# EAGLE design Mixer-Analog-OPA1644-Rev-C (EAGLE 8.4.3)
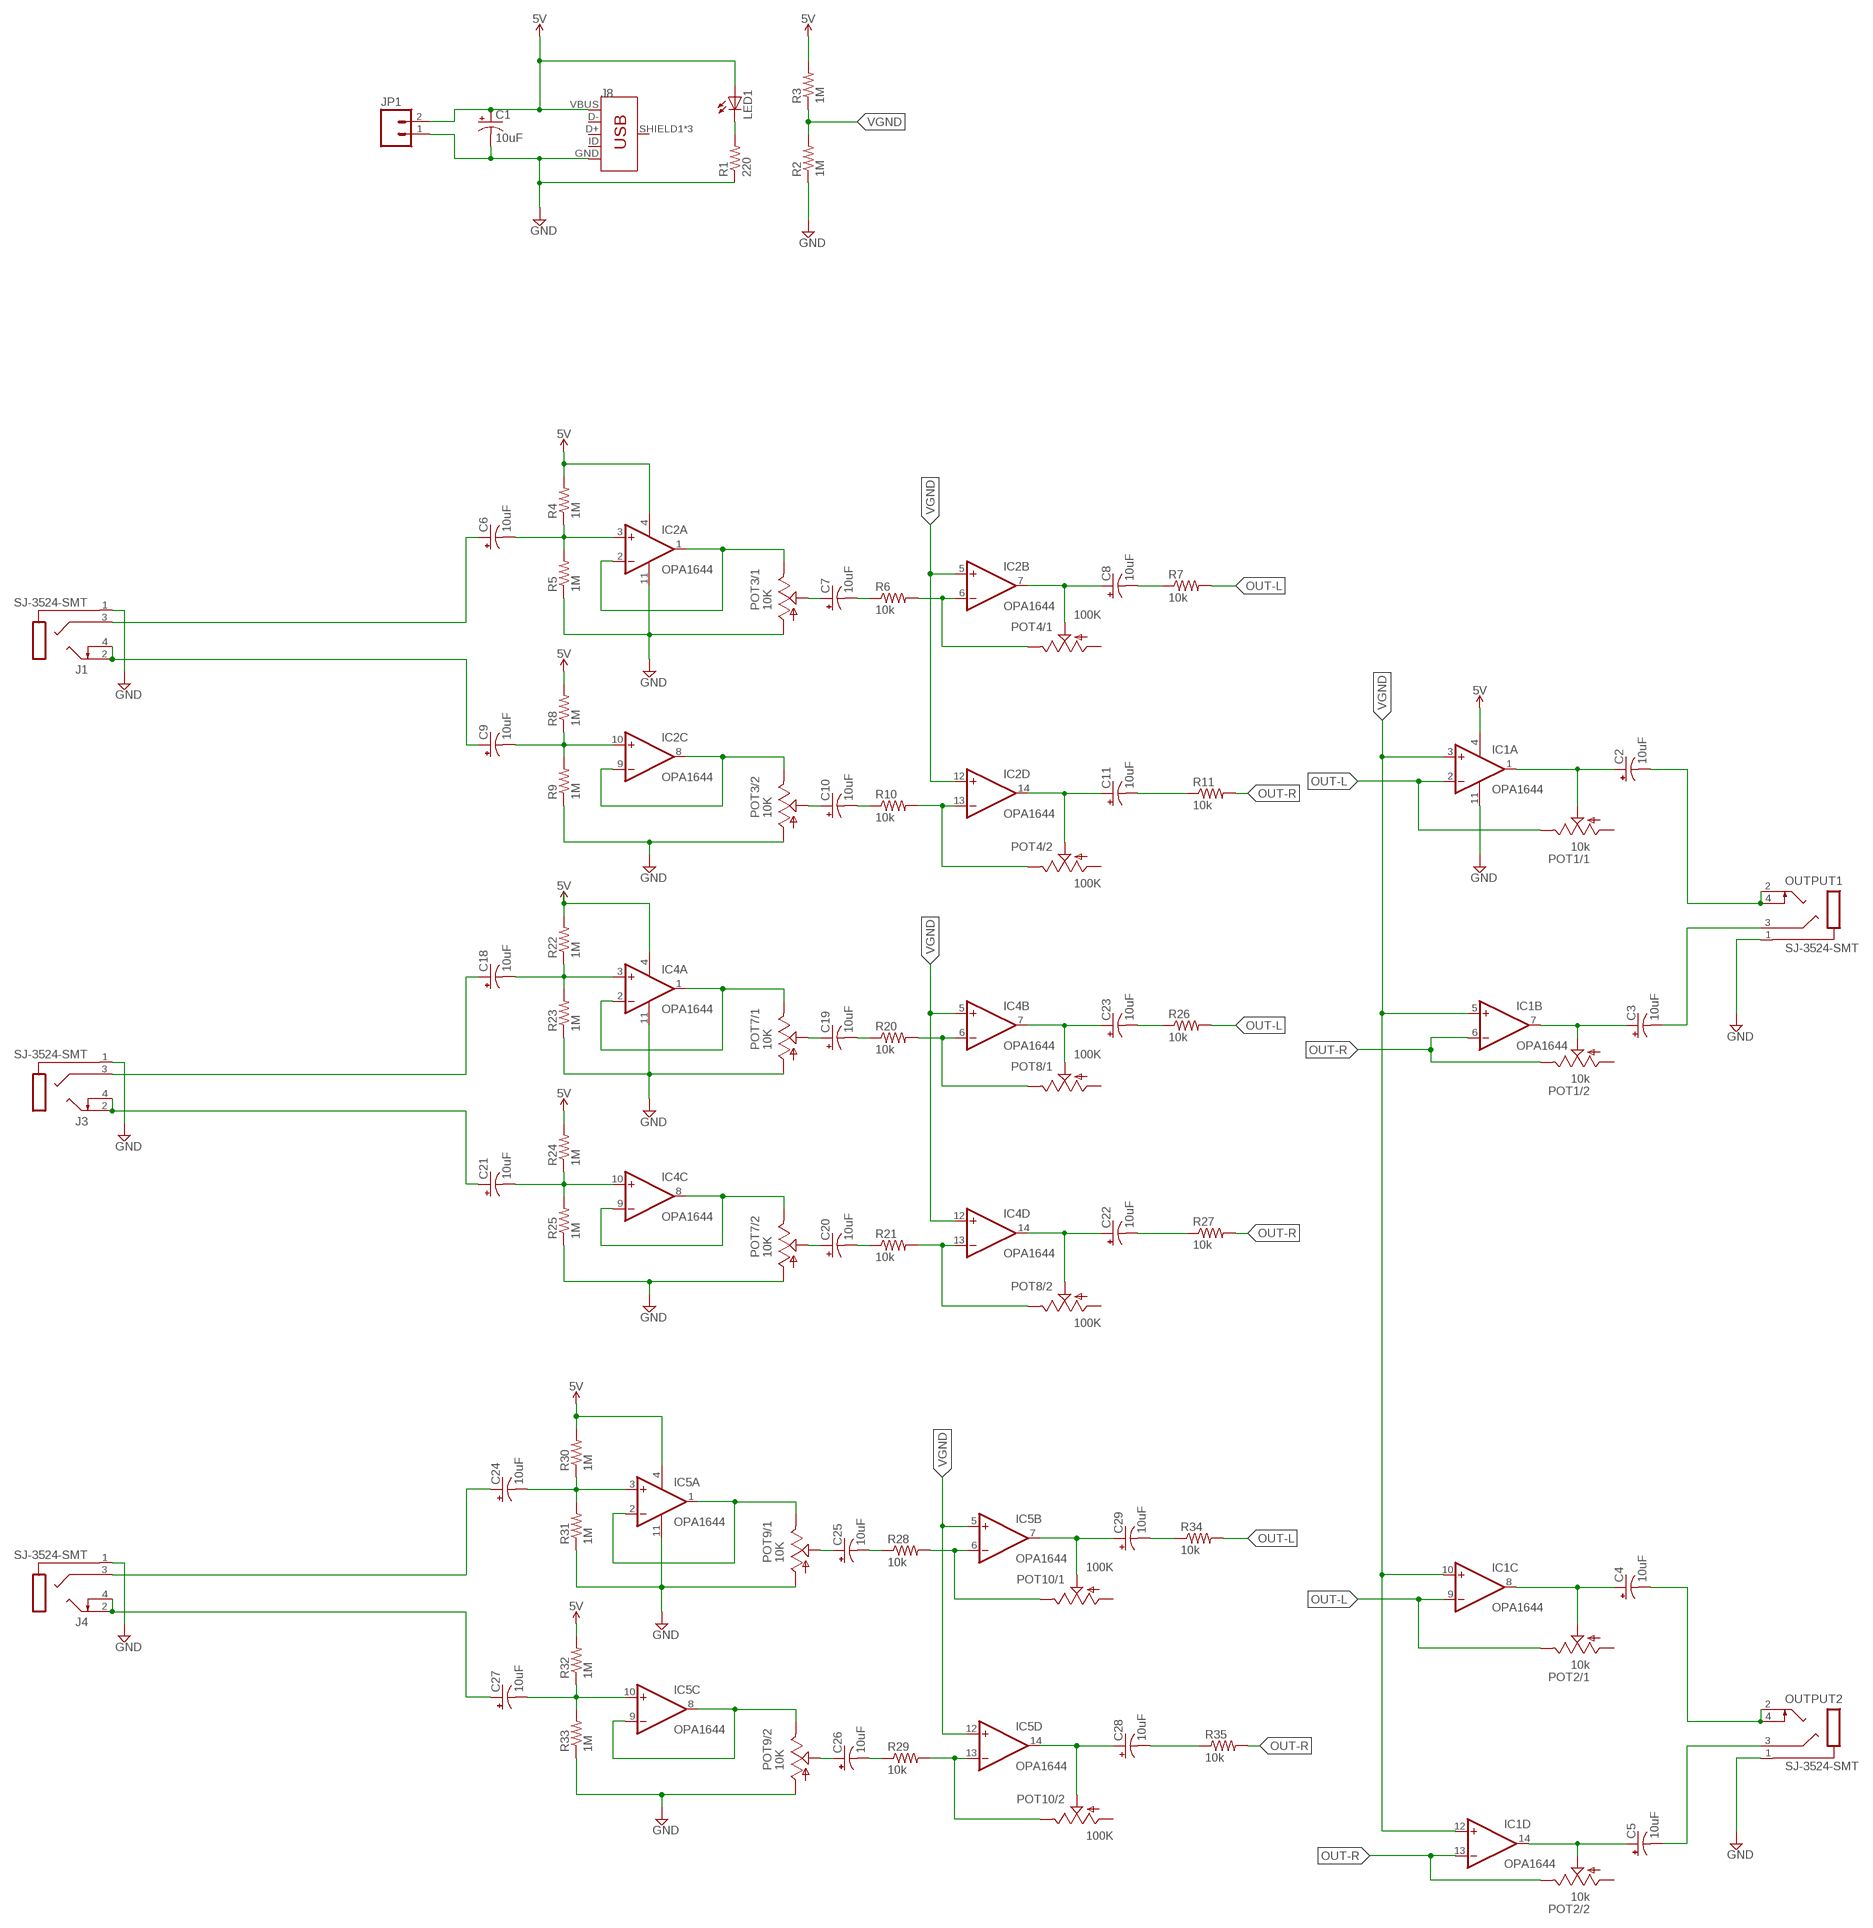
[diagram p0: schematic, sheet 1, part 1 of 2]
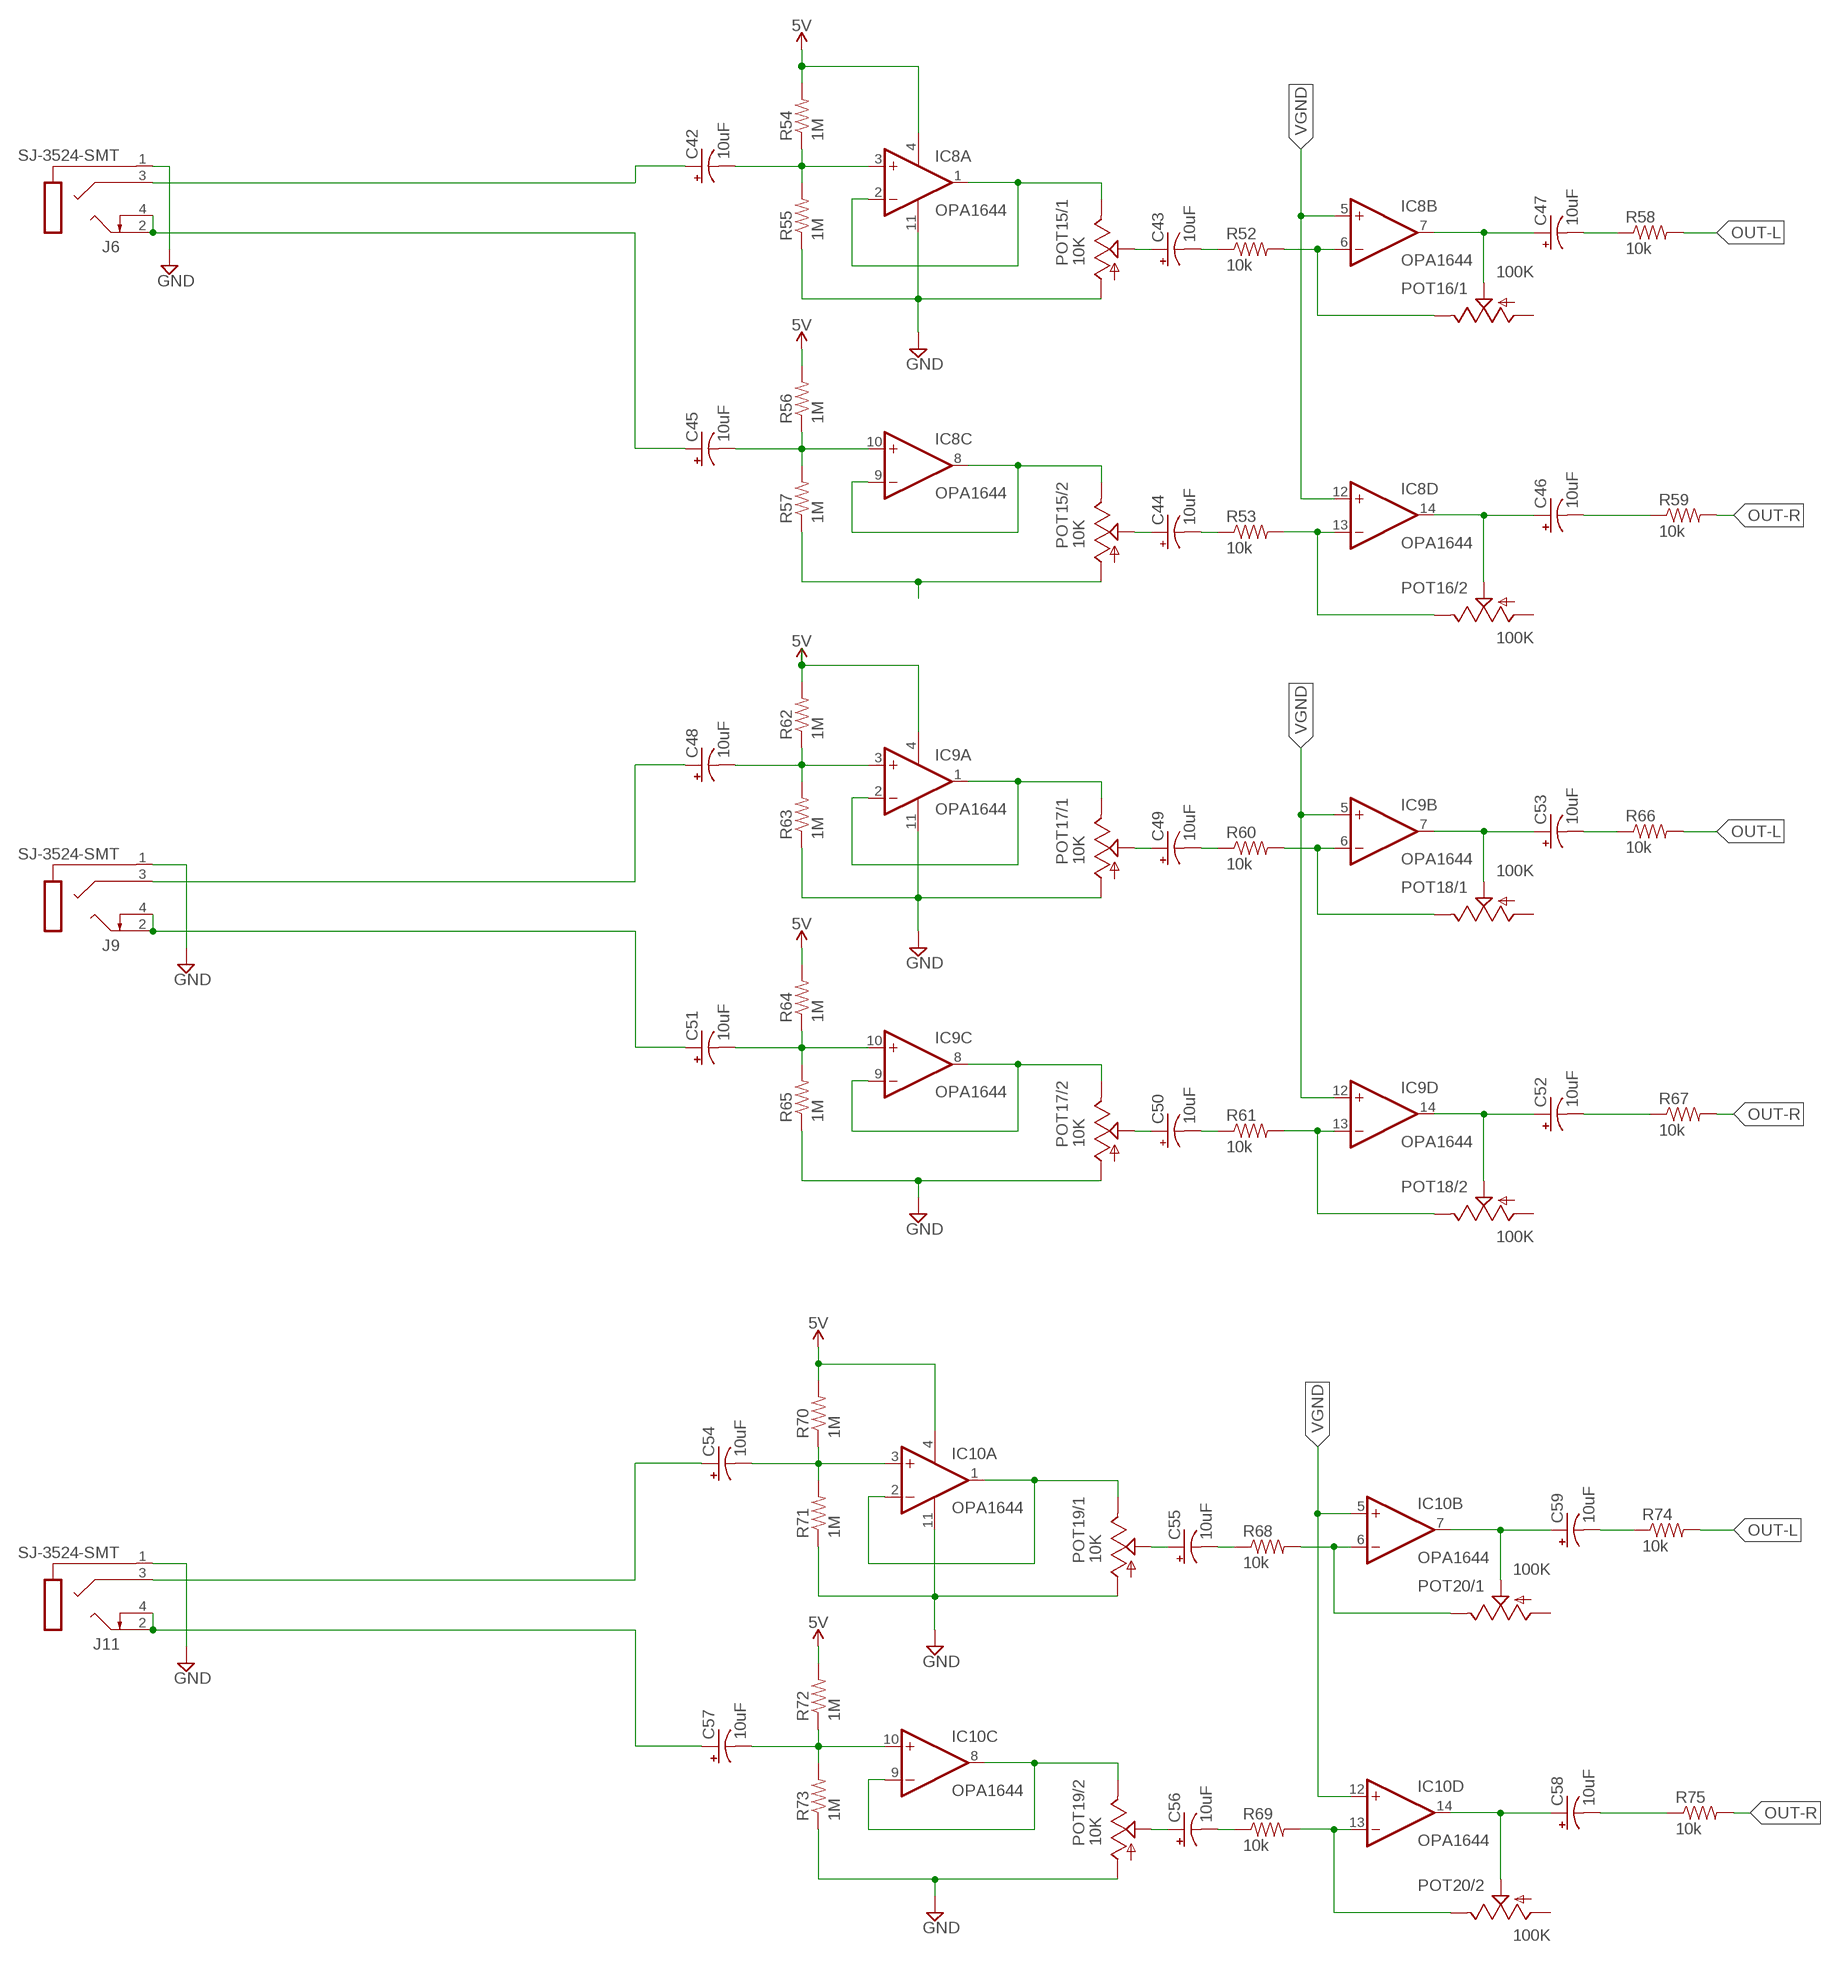
[diagram p1: schematic, sheet 1, part 2 of 2]

## Parts
C1  10uF  CAP_POL1206-KIT  [EIA3216-KIT]
C2  10uF  CAP_POL1206-KIT  [EIA3216-KIT]
C3  10uF  CAP_POL1206-KIT  [EIA3216-KIT]
C4  10uF  CAP_POL1206-KIT  [EIA3216-KIT]
C5  10uF  CAP_POL1206-KIT  [EIA3216-KIT]
C6  10uF  CAP_POL1206-KIT  [EIA3216-KIT]
C7  10uF  CAP_POL1206-KIT  [EIA3216-KIT]
C8  10uF  CAP_POL1206-KIT  [EIA3216-KIT]
C9  10uF  CAP_POL1206-KIT  [EIA3216-KIT]
C10  10uF  CAP_POL1206-KIT  [EIA3216-KIT]
C11  10uF  CAP_POL1206-KIT  [EIA3216-KIT]
C18  10uF  CAP_POL1206-KIT  [EIA3216-KIT]
C19  10uF  CAP_POL1206-KIT  [EIA3216-KIT]
C20  10uF  CAP_POL1206-KIT  [EIA3216-KIT]
C21  10uF  CAP_POL1206-KIT  [EIA3216-KIT]
C22  10uF  CAP_POL1206-KIT  [EIA3216-KIT]
C23  10uF  CAP_POL1206-KIT  [EIA3216-KIT]
C24  10uF  CAP_POL1206-KIT  [EIA3216-KIT]
C25  10uF  CAP_POL1206-KIT  [EIA3216-KIT]
C26  10uF  CAP_POL1206-KIT  [EIA3216-KIT]
C27  10uF  CAP_POL1206-KIT  [EIA3216-KIT]
C28  10uF  CAP_POL1206-KIT  [EIA3216-KIT]
C29  10uF  CAP_POL1206-KIT  [EIA3216-KIT]
C42  10uF  CAP_POL1206-KIT  [EIA3216-KIT]
C43  10uF  CAP_POL1206-KIT  [EIA3216-KIT]
C44  10uF  CAP_POL1206-KIT  [EIA3216-KIT]
C45  10uF  CAP_POL1206-KIT  [EIA3216-KIT]
C46  10uF  CAP_POL1206-KIT  [EIA3216-KIT]
C47  10uF  CAP_POL1206-KIT  [EIA3216-KIT]
C48  10uF  CAP_POL1206-KIT  [EIA3216-KIT]
C49  10uF  CAP_POL1206-KIT  [EIA3216-KIT]
C50  10uF  CAP_POL1206-KIT  [EIA3216-KIT]
C51  10uF  CAP_POL1206-KIT  [EIA3216-KIT]
C52  10uF  CAP_POL1206-KIT  [EIA3216-KIT]
C53  10uF  CAP_POL1206-KIT  [EIA3216-KIT]
C54  10uF  CAP_POL1206-KIT  [EIA3216-KIT]
C55  10uF  CAP_POL1206-KIT  [EIA3216-KIT]
C56  10uF  CAP_POL1206-KIT  [EIA3216-KIT]
C57  10uF  CAP_POL1206-KIT  [EIA3216-KIT]
C58  10uF  CAP_POL1206-KIT  [EIA3216-KIT]
C59  10uF  CAP_POL1206-KIT  [EIA3216-KIT]
IC1  OPA1644  [TSSOP14]
IC2  OPA1644  [TSSOP14]
IC4  OPA1644  [TSSOP14]
IC5  OPA1644  [TSSOP14]
IC8  OPA1644  [TSSOP14]
IC9  OPA1644  [TSSOP14]
IC10  OPA1644  [TSSOP14]
J1  SJ-3524-SMT  [SJ-3524-SMT]
J3  SJ-3524-SMT  [SJ-3524-SMT]
J4  SJ-3524-SMT  [SJ-3524-SMT]
J6  SJ-3524-SMT  [SJ-3524-SMT]
J8  USB_MICRO-B_FEMALE-SMT  [USB-B-MICRO-SMD]
J9  SJ-3524-SMT  [SJ-3524-SMT]
J11  SJ-3524-SMT  [SJ-3524-SMT]
JP1  M02LOCK  [1X02_LOCK]
LED1  LED3MM  [LED3MM]
OUTPUT1  SJ-3524-SMT  [SJ-3524-SMT]
OUTPUT2  SJ-3524-SMT  [SJ-3524-SMT]
POT1  10k  POT-DUAL-PTV112-4420  [PTV112]
POT2  10k  POT-DUAL-PTV112-4420  [PTV112]
POT3  10K  POT-DUAL-PTV112-4420  [PTV112]
POT4  100K  POT-DUAL-PTV112-4420  [PTV112]
POT7  10K  POT-DUAL-PTV112-4420  [PTV112]
POT8  100K  POT-DUAL-PTV112-4420  [PTV112]
POT9  10K  POT-DUAL-PTV112-4420  [PTV112]
POT10  100K  POT-DUAL-PTV112-4420  [PTV112]
POT15  10K  POT-DUAL-PTV112-4420  [PTV112]
POT16  100K  POT-DUAL-PTV112-4420  [PTV112]
POT17  10K  POT-DUAL-PTV112-4420  [PTV112]
POT18  100K  POT-DUAL-PTV112-4420  [PTV112]
POT19  10K  POT-DUAL-PTV112-4420  [PTV112]
POT20  100K  POT-DUAL-PTV112-4420  [PTV112]
R1  220  RESISTOR0603-RES  [0603-RES]
R2  1M  RESISTOR0603-RES  [0603-RES]
R3  1M  RESISTOR0603-RES  [0603-RES]
R4  1M  RESISTOR0603-RES  [0603-RES]
R5  1M  RESISTOR0603-RES  [0603-RES]
R6  10k  RESISTOR0603-RES  [0603-RES]
R7  10k  RESISTOR0603-RES  [0603-RES]
R8  1M  RESISTOR0603-RES  [0603-RES]
R9  1M  RESISTOR0603-RES  [0603-RES]
R10  10k  RESISTOR0603-RES  [0603-RES]
R11  10k  RESISTOR0603-RES  [0603-RES]
R20  10k  RESISTOR0603-RES  [0603-RES]
R21  10k  RESISTOR0603-RES  [0603-RES]
R22  1M  RESISTOR0603-RES  [0603-RES]
R23  1M  RESISTOR0603-RES  [0603-RES]
R24  1M  RESISTOR0603-RES  [0603-RES]
R25  1M  RESISTOR0603-RES  [0603-RES]
R26  10k  RESISTOR0603-RES  [0603-RES]
R27  10k  RESISTOR0603-RES  [0603-RES]
R28  10k  RESISTOR0603-RES  [0603-RES]
R29  10k  RESISTOR0603-RES  [0603-RES]
R30  1M  RESISTOR0603-RES  [0603-RES]
R31  1M  RESISTOR0603-RES  [0603-RES]
R32  1M  RESISTOR0603-RES  [0603-RES]
R33  1M  RESISTOR0603-RES  [0603-RES]
R34  10k  RESISTOR0603-RES  [0603-RES]
R35  10k  RESISTOR0603-RES  [0603-RES]
R52  10k  RESISTOR0603-RES  [0603-RES]
R53  10k  RESISTOR0603-RES  [0603-RES]
R54  1M  RESISTOR0603-RES  [0603-RES]
R55  1M  RESISTOR0603-RES  [0603-RES]
R56  1M  RESISTOR0603-RES  [0603-RES]
R57  1M  RESISTOR0603-RES  [0603-RES]
R58  10k  RESISTOR0603-RES  [0603-RES]
R59  10k  RESISTOR0603-RES  [0603-RES]
R60  10k  RESISTOR0603-RES  [0603-RES]
R61  10k  RESISTOR0603-RES  [0603-RES]
R62  1M  RESISTOR0603-RES  [0603-RES]
R63  1M  RESISTOR0603-RES  [0603-RES]
R64  1M  RESISTOR0603-RES  [0603-RES]
R65  1M  RESISTOR0603-RES  [0603-RES]
R66  10k  RESISTOR0603-RES  [0603-RES]
R67  10k  RESISTOR0603-RES  [0603-RES]
R68  10k  RESISTOR0603-RES  [0603-RES]
R69  10k  RESISTOR0603-RES  [0603-RES]
R70  1M  RESISTOR0603-RES  [0603-RES]
R71  1M  RESISTOR0603-RES  [0603-RES]
R72  1M  RESISTOR0603-RES  [0603-RES]
R73  1M  RESISTOR0603-RES  [0603-RES]
R74  10k  RESISTOR0603-RES  [0603-RES]
R75  10k  RESISTOR0603-RES  [0603-RES]

## Nets
5V: C1.A(+) IC1.4(P:V+) IC2.4(P:V+) IC5.4(P:V+) IC8.4(P:V+) IC10.4(P:V+) J8.VBUS JP1.2 LED1.A R3.2 R4.2 R8.2 R24.2 R30.2 R32.2 R54.2 R56.2 R64.2 R70.2 R72.2
COPY\: IC2.1(A:OUT) IC2.2(A:-IN) POT3.1.3(/1:E)
COPY\2: IC4.1(A:OUT) IC4.2(A:-IN) POT7.1.3(/1:E)
COPY\3: IC5.1(A:OUT) IC5.2(A:-IN) POT9.1.3(/1:E)
COPY\6: IC8.1(A:OUT) IC8.2(A:-IN) POT15.1.3(/1:E)
COPY\7: IC9.1(A:OUT) IC9.2(A:-IN) POT17.1.3(/1:E)
COPY\8: IC10.1(A:OUT) IC10.2(A:-IN) POT19.1.3(/1:E)
DLE: C8.A(+) IC2.7(B:OUT) POT4.1.2(/1:S)
DLE2: C23.A(+) IC4.7(B:OUT) POT8.1.2(/1:S)
DLE3: C29.A(+) IC5.7(B:OUT) POT10.1.2(/1:S)
DLE6: C47.A(+) IC8.7(B:OUT) POT16.1.2(/1:S)
DLE7: C53.A(+) IC9.7(B:OUT) POT18.1.2(/1:S)
DLE8: C59.A(+) IC10.7(B:OUT) POT20.1.2(/1:S)
GND: C1.C(-) IC1.11(P:V-) IC2.11(P:V-) IC4.11(P:V-) IC5.11(P:V-) IC8.11(P:V-) IC9.11(P:V-) IC10.11(P:V-) J1.1(S) J3.1(S) J4.1(S) J6.1(S) J8.GND J9.1(S) J11.1(S) JP1.1 OUTPUT1.1(S) OUTPUT2.1(S) POT3.1.1(/1:A) POT3.2.1(/2:A) POT7.1.1(/1:A) POT7.2.1(/2:A) POT9.1.1(/1:A) POT9.2.1(/2:A) POT15.1.1(/1:A) POT15.2.1(/2:A) POT17.1.1(/1:A) POT17.2.1(/2:A) POT19.1.1(/1:A) POT19.2.1(/2:A) R1.1 R2.1 R5.1 R9.1 R23.1 R25.1 R31.1 R33.1 R55.1 R57.1 R63.1 R65.1 R71.1 R73.1
N$1: IC2.13(D:-IN) POT4.2.3(/2:E) R10.2
N$2: C8.C(-) R7.1
N$3: C7.A(+) POT3.1.2(/1:S)
N$4: IC2.6(B:-IN) POT4.1.3(/1:E) R6.2
N$5: C6.C(-) IC2.3(A:+IN) R4.1 R5.2
N$6: C11.C(-) R11.1
N$7: C2.A(+) IC1.1(A:OUT) POT1.1.2(/1:S)
N$8: C7.C(-) R6.1
N$9: IC2.8(C:OUT) IC2.9(C:-IN) POT3.2.3(/2:E)
N$10: C6.A(+) J1.3(R)
N$11: C9.C(-) IC2.10(C:+IN) R8.1 R9.2
N$12: C9.A(+) J1.2(T) J1.4(TS)
N$13: C10.A(+) POT3.2.2(/2:S)
N$14: C10.C(-) R10.1
N$15: LED1.K(C) R1.2
N$17: C3.A(+) IC1.7(B:OUT) POT1.2.2(/2:S)
N$18: C4.C(-) OUTPUT2.2(T) OUTPUT2.4(TS)
N$19: C5.C(-) OUTPUT2.3(R)
N$21: C4.A(+) IC1.8(C:OUT) POT2.1.2(/1:S)
N$23: C5.A(+) IC1.14(D:OUT) POT2.2.2(/2:S)
N$24: C11.A(+) IC2.14(D:OUT) POT4.2.2(/2:S)
N$34: C22.A(+) IC4.14(D:OUT) POT8.2.2(/2:S)
N$35: IC4.13(D:-IN) POT8.2.3(/2:E) R21.2
N$36: IC4.8(C:OUT) IC4.9(C:-IN) POT7.2.3(/2:E)
N$37: C18.C(-) IC4.3(A:+IN) R22.1 R23.2
N$38: C21.A(+) J3.2(T) J3.4(TS)
N$39: C21.C(-) IC4.10(C:+IN) R24.1 R25.2
N$40: C18.A(+) J3.3(R)
N$41: C19.A(+) POT7.1.2(/1:S)
N$42: C19.C(-) R20.1
N$43: IC4.6(B:-IN) POT8.1.3(/1:E) R20.2
N$44: C20.A(+) POT7.2.2(/2:S)
N$45: C20.C(-) R21.1
N$46: C23.C(-) R26.1
N$47: C22.C(-) R27.1
N$48: IC4.4(P:V+) R22.2
N$49: C28.A(+) IC5.14(D:OUT) POT10.2.2(/2:S)
N$50: IC5.13(D:-IN) POT10.2.3(/2:E) R29.2
N$51: C27.A(+) J4.2(T) J4.4(TS)
N$52: IC5.8(C:OUT) IC5.9(C:-IN) POT9.2.3(/2:E)
N$53: C24.A(+) J4.3(R)
N$54: C24.C(-) IC5.3(A:+IN) R30.1 R31.2
N$55: C27.C(-) IC5.10(C:+IN) R32.1 R33.2
N$56: C25.A(+) POT9.1.2(/1:S)
N$57: C25.C(-) R28.1
N$58: IC5.6(B:-IN) POT10.1.3(/1:E) R28.2
N$59: C26.A(+) POT9.2.2(/2:S)
N$60: C26.C(-) R29.1
N$61: C2.C(-) OUTPUT1.2(T) OUTPUT1.4(TS)
N$62: C3.C(-) OUTPUT1.3(R)
N$63: C29.C(-) R34.1
N$64: C28.C(-) R35.1
N$79: C45.A(+) J6.2(T) J6.4(TS)
N$81: C42.A(+) J6.3(R)
N$92: C46.A(+) IC8.14(D:OUT) POT16.2.2(/2:S)
N$93: IC8.13(D:-IN) POT16.2.3(/2:E) R53.2
N$94: IC8.8(C:OUT) IC8.9(C:-IN) POT15.2.3(/2:E)
N$95: C42.C(-) IC8.3(A:+IN) R54.1 R55.2
N$96: C45.C(-) IC8.10(C:+IN) R56.1 R57.2
N$97: C43.A(+) POT15.1.2(/1:S)
N$98: C43.C(-) R52.1
N$99: IC8.6(B:-IN) POT16.1.3(/1:E) R52.2
N$100: C44.A(+) POT15.2.2(/2:S)
N$101: C44.C(-) R53.1
N$102: C47.C(-) R58.1
N$103: C46.C(-) R59.1
N$104: C52.A(+) IC9.14(D:OUT) POT18.2.2(/2:S)
N$105: C51.A(+) J9.2(T) J9.4(TS)
N$106: IC9.13(D:-IN) POT18.2.3(/2:E) R61.2
N$107: C48.A(+) J9.3(R)
N$108: IC9.8(C:OUT) IC9.9(C:-IN) POT17.2.3(/2:E)
N$109: C48.C(-) IC9.3(A:+IN) R62.1 R63.2
N$110: C51.C(-) IC9.10(C:+IN) R64.1 R65.2
N$111: C49.A(+) POT17.1.2(/1:S)
N$112: C49.C(-) R60.1
N$113: IC9.6(B:-IN) POT18.1.3(/1:E) R60.2
N$114: C50.A(+) POT17.2.2(/2:S)
N$115: C50.C(-) R61.1
N$116: C53.C(-) R66.1
N$117: C52.C(-) R67.1
N$118: IC9.4(P:V+) R62.2
N$119: C58.A(+) IC10.14(D:OUT) POT20.2.2(/2:S)
N$120: IC10.13(D:-IN) POT20.2.3(/2:E) R69.2
N$121: IC10.8(C:OUT) IC10.9(C:-IN) POT19.2.3(/2:E)
N$122: C54.C(-) IC10.3(A:+IN) R70.1 R71.2
N$123: C57.C(-) IC10.10(C:+IN) R72.1 R73.2
N$124: C55.A(+) POT19.1.2(/1:S)
N$125: C55.C(-) R68.1
N$126: IC10.6(B:-IN) POT20.1.3(/1:E) R68.2
N$127: C56.A(+) POT19.2.2(/2:S)
N$128: C56.C(-) R69.1
N$129: C59.C(-) R74.1
N$130: C58.C(-) R75.1
N$131: C57.A(+) J11.2(T) J11.4(TS)
N$132: C54.A(+) J11.3(R)
OUT-L: IC1.2(A:-IN) IC1.9(C:-IN) POT1.1.3(/1:E) POT2.1.3(/1:E) R7.2 R26.2 R34.2 R58.2 R66.2 R74.2
OUT-R: IC1.6(B:-IN) IC1.13(D:-IN) POT1.2.3(/2:E) POT2.2.3(/2:E) R11.2 R27.2 R35.2 R59.2 R67.2 R75.2
VGND: IC1.3(A:+IN) IC1.5(B:+IN) IC1.10(C:+IN) IC1.12(D:+IN) IC2.5(B:+IN) IC2.12(D:+IN) IC4.5(B:+IN) IC4.12(D:+IN) IC5.5(B:+IN) IC5.12(D:+IN) IC8.5(B:+IN) IC8.12(D:+IN) IC9.5(B:+IN) IC9.12(D:+IN) IC10.5(B:+IN) IC10.12(D:+IN) R2.2 R3.1
Unconnected: J8.D+ J8.D- J8.ID J8.SHIELD1(SHIELD) J8.SHIELD2(SHIELD) J8.SHIELD3(SHIELD) POT1.1.1(/1:A) POT1.2.1(/2:A) POT2.1.1(/1:A) POT2.2.1(/2:A) POT4.1.1(/1:A) POT4.2.1(/2:A) POT8.1.1(/1:A) POT8.2.1(/2:A) POT10.1.1(/1:A) POT10.2.1(/2:A) POT16.1.1(/1:A) POT16.2.1(/2:A) POT18.1.1(/1:A) POT18.2.1(/2:A) POT20.1.1(/1:A) POT20.2.1(/2:A)

## Library data of the parts
C1-C5 = SparkFun-Passives:CAP_POL: Capacitor Polarized These are standard SMD and PTH capacitors. Normally 10uF, 47uF, and 100uF in electrolytic and tantalum varieties. Always verify the external diameter of the through hole cap, it varies with capacity, voltage, and manufacturer. The EIA devices should be standard.
C6-C11 C18-C29 C42-C59 = SparkFun-Passives:CAP_POL: Capacitor Polarized These are standard SMD and PTH capacitors. Normally 10uF, 47uF, and 100uF in electrolytic and tantalum varieties. Always verify the external diameter of the through hole cap, it varies with capacity, voltage, and manufacturer. The EIA devices should be standard.; SPICEPREFIX: C
IC1 = CMU-ArtFab:OPA1644: OPA164x SoundPlus™ High-Performance, JFET-Input Audio Operational Amplifiers Source: http://www.ti.com/lit/ds/symlink/opa1642.pdf
IC2 IC4 IC5 IC8-IC10 = CMU-ArtFab:OPA1644: OPA164x SoundPlus™ High-Performance, JFET-Input Audio Operational Amplifiers Source: http://www.ti.com/lit/ds/symlink/opa1642.pdf; SPICEPREFIX: B
J1 J3 J4 J6 J9 J11 = con-cuistack:SJ-3524: 3.5 Stereo audio jack (SMT); SPICEPREFIX: E
J8 = SparkFun-Connectors:USB_MICRO-B: USB Type Micro-B Connector Male/female and PTH/SMT variants SparkFun Products: SparkFun microB USB Breakout <https://www.sparkfun.com/products/12035> SparkFun USB microB Plug Breakout <https://www.sparkfun.com/products/10031> SparkFun ESP8266 Thing <https://www.sparkfun.com/products/13231>; PROD_ID: CONN-11752
JP1 = CMU-ArtFab:M02: Header 2 Standard 2-pin 0.1" header. Use with straight break away headers (SKU : PRT-00116), right angle break away headers (PRT-00553), swiss pins (PRT-00743), machine pins (PRT-00117), and female headers (PRT-00115). Molex polarized connector foot print use with SKU : PRT-08233 with associated crimp pins and housings.
LED1 = led:LED: LED OSRAM: - CHIPLED LG R971, LG N971, LY N971, LG Q971, LY Q971, LO R971, LY R971 LH N974, LH R974 LS Q976, LO Q976, LY Q976 LO Q996 - Hyper CHIPLED LW Q18S LB Q993, LB Q99A, LB R99A - SideLED LS A670, LO A670, LY A670, LG A670, LP A670 LB A673, LV A673, LT A673, LW A673 LH A674 LY A675 LS A676, LA A676, LO A676, LY A676, LW A676 LS A679, LY A679, LG A679 - Hyper Micro SIDELED® LS Y876, LA Y876, LO Y876, LY Y876 LT Y87S - SmartLED LW L88C, LW L88S LB L89C, LB L89S, LG L890 LS L89K, LO L89K, LY L89K LS L896, LA L896, LO L896, LY L896 - TOPLED LS T670, LO T670, LY T670, LG T670, LP T670 LSG T670, LSP T670, LSY T670, LOP T670, LYG T670 LG T671, LOG T671, LSG T671 LB T673, LV T673, LT T673, LW T673 LH T674 LS T676, LA T676, LO T676, LY T676, LB T676, LH T676, LSB T676, LW T676 LB T67C, LV T67C, LT T67C, LS T67K, LO T67K, LY T67K, LW E67C LS E67B, LA E67B, LO E67B, LY E67B, LB E67C, LV E67C, LT E67C LW T67C LS T679, LY T679, LG T679 LS T770, LO T770, LY T770, LG T770, LP T770 LB T773, LV T773, LT T773, LW T773 LH T774 LS E675, LA E675, LY E675, LS T675 LS T776, LA T776, LO T776, LY T776, LB T776 LHGB T686 LT T68C, LB T68C - Hyper Mini TOPLED® LB M676 - Mini TOPLED Santana® LG M470 LS M47K, LO M47K, LY M47K Source: http://www.osram.convergy.de LUXEON: - LUMILED® LXK2-PW12-R00, LXK2-PW12-S00, LXK2-PW14-U00, LXK2-PW14-V00 LXK2-PM12-R00, LXK2-PM12-S00, LXK2-PM14-U00 LXK2-PE12-Q00, LXK2-PE12-R00, LXK2-PE12-S00, LXK2-PE14-T00, LXK2-PE14-U00 LXK2-PB12-K00, LXK2-PB12-L00, LXK2-PB12-M00, LXK2-PB14-N00, LXK2-PB14-P00, LXK2-PB14-Q00 LXK2-PR12-L00, LXK2-PR12-M00, LXK2-PR14-Q00, LXK2-PR14-R00 LXK2-PD12-Q00, LXK2-PD12-R00, LXK2-PD12-S00 LXK2-PH12-R00, LXK2-PH12-S00 LXK2-PL12-P00, LXK2-PL12-Q00, LXK2-PL12-R00 Source: www.luxeon.com KINGBRIGHT: KA-3528ASYC Source: www.kingbright.com
OUTPUT1 OUTPUT2 = con-cuistack:SJ-3524: 3.5 Stereo audio jack (SMT)
POT1 POT2 = CMU-ArtFab:POT-DUAL-PTV112: Bourns 11mm dual potentiometer; AVAILABILITY: Unavailable; DESCRIPTION: Alt# Tce-10111410; MF: STMicroelectronics; MP: PTV112; PACKAGE: None; PRICE: None
POT3 POT4 POT7-POT10 POT15-POT20 = CMU-ArtFab:POT-DUAL-PTV112: Bourns 11mm dual potentiometer; AVAILABILITY: Unavailable; DESCRIPTION: Alt# Tce-10111410; MF: STMicroelectronics; MP: PTV112; PACKAGE: None; PRICE: None; SPICEPREFIX: J
R1-R3 = SparkFun-Passives:RESISTOR: Resistor Basic schematic elements and footprints for 0603, 1206, and PTH resistors.
R4-R11 R20-R35 R52-R75 = SparkFun-Passives:RESISTOR: Resistor Basic schematic elements and footprints for 0603, 1206, and PTH resistors.; SPICEPREFIX: R

## Board
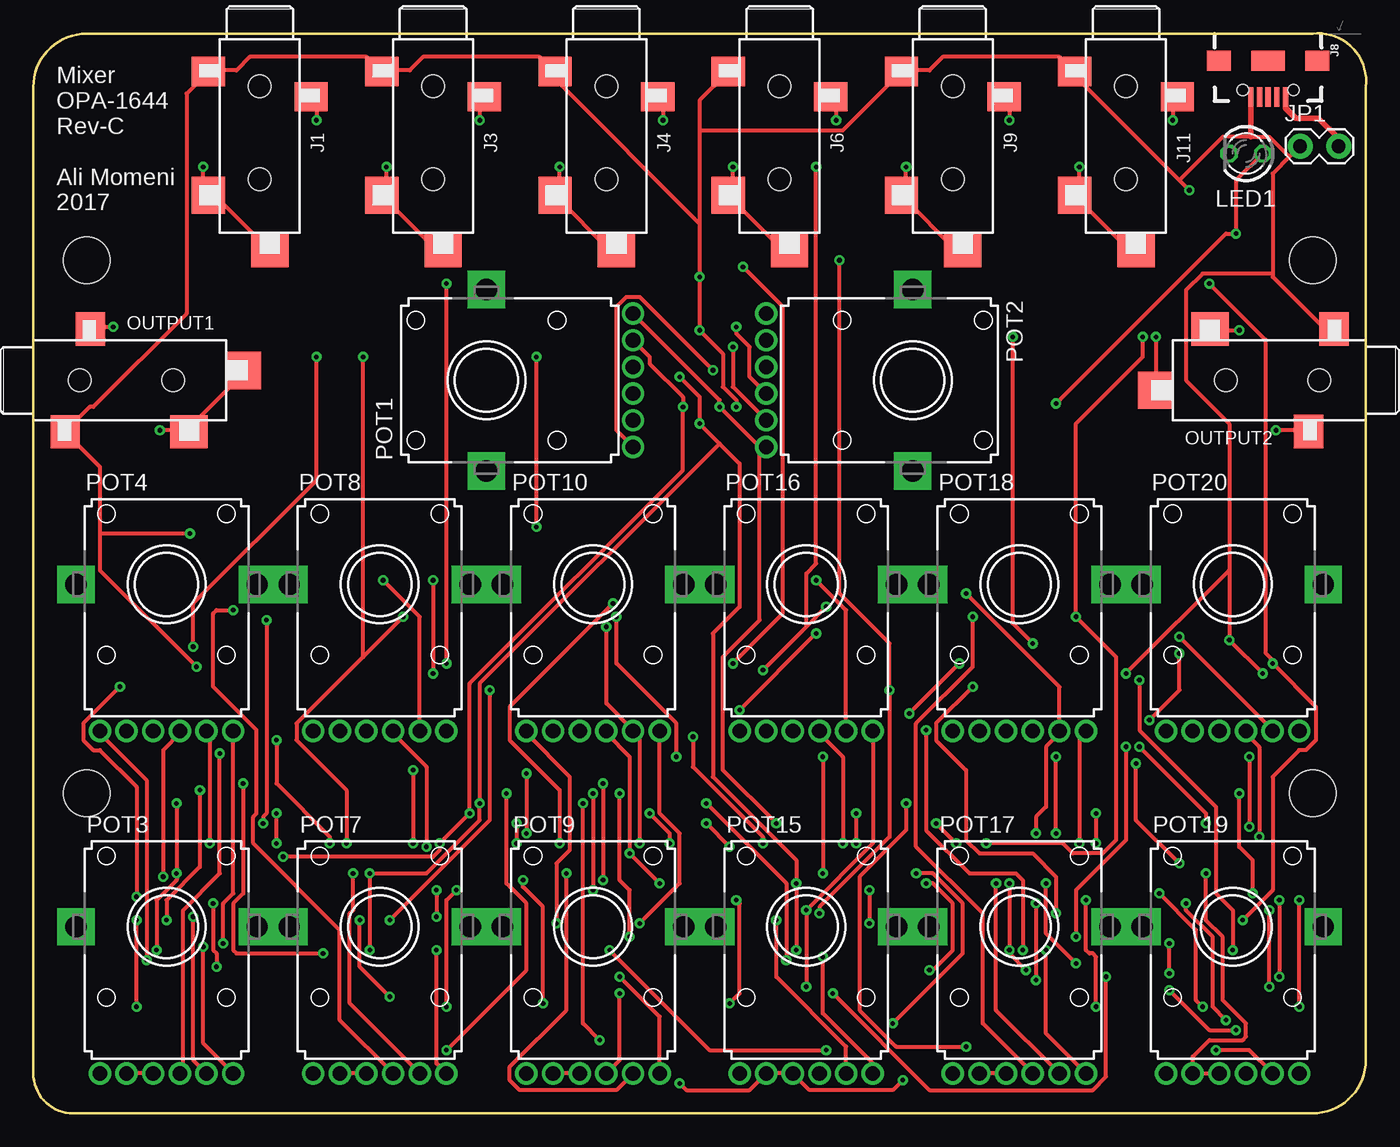
[diagram p2: board, top side]
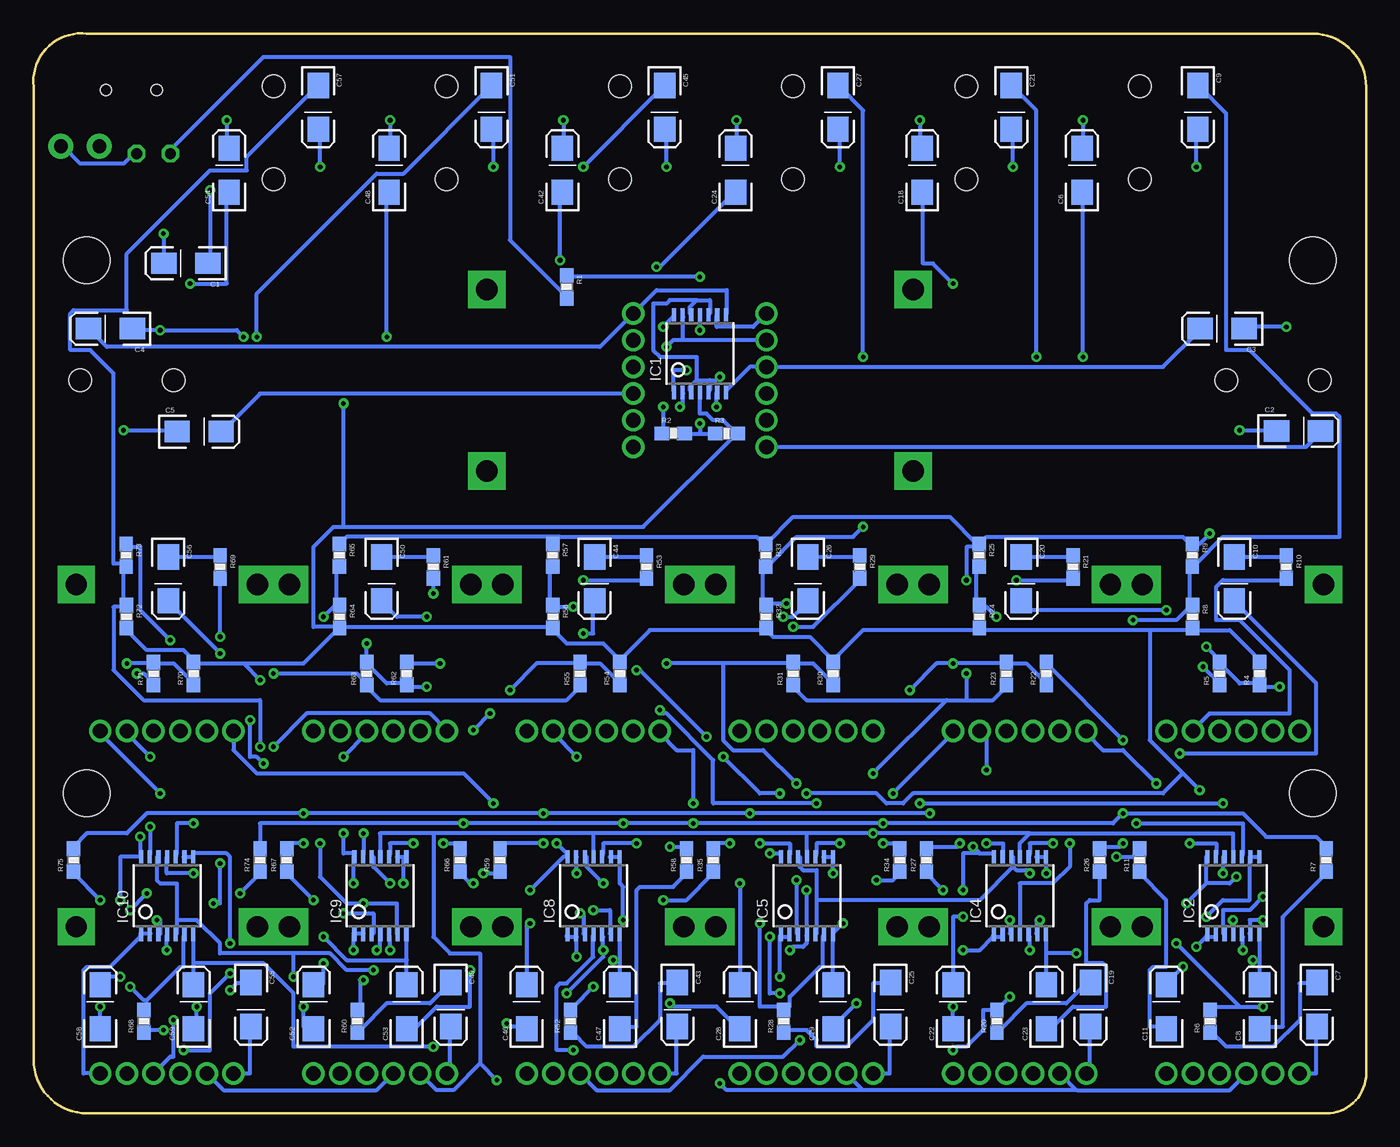
[diagram p3: board, bottom side, seen from below]

Size 100.02 x 81.02 mm. Coordinates in mm from the lower left corner, seen from the top.
Outline: 0,3 arc90 3,0 96,0 arc90 100,4 100,77 arc103 96,81 4,81 arc90 0,77 0,3
Copper layers (1*16): Top 0.035mm / dielectric 1.5mm / Bottom 0.035mm
Design rules "default *": minimum track width 12mil, minimum drill 0.35mm, track to track 8mil, track to pad 8mil, pad to pad 8mil, via to via 8mil, smd to smd 8mil, copper to edge 40mil, drill to drill 6mil, minimum pad ring 10mil, minimum via ring 8mil, stop-mask expansion 4mil, vias tented up to drill 0mil, thermal gap 10mil
Holes 3.5 mm at 96,64 4,64 96,24 4,24

### Footprints (pad centres in the part's own frame; a part is rotated, then mirrored left to right if it is on the bottom)
EIA3216-KIT = smd 1.9 x 1.6: A 1.65,0; C -1.65,0
TSSOP14 = smd 0.305 x 0.991: 1 -1.95,-2.918; 2 -1.3,-2.918; 3 -0.65,-2.918; 4 0,-2.918; 5 0.65,-2.918; 6 1.3,-2.918; 7 1.95,-2.918; 8 1.95,2.918; 9 1.3,2.918; 10 0.65,2.918; 11 0,2.918; 12 -0.65,2.918; 13 -1.3,2.918; 14 -1.95,2.918
SJ-3524-SMT = smd 2.5 x 2.2: 1 3.85,-4.6; 3 -3.85,-2.7 | smd 2.5 x 2.8: 2 3.85,4.7 | smd 2.8 x 2.5: 4 -0.75,8.85 | hole 1.7: 0,-3.5; 0,3.5
USB-B-MICRO-SMD = smd 1.45 x 0.4: D+ 2.725,0; D- 2.725,0.65; GND 2.725,-1.3; ID 2.725,-0.65; VBUS 2.725,1.3 | smd 1.5 x 1.8: SHIELD1 0,3.685; SHIELD2 0,-3.685 | smd 1.5 x 2.5: SHIELD3 0,0 | hole 0.85: 2.2,1.9; 2.2,-1.9
1X02_LOCK = drill 1.016 pad 1.88: 1 -0.178,0; 2 2.718,0
LED3MM = drill 0.813 octagon: A -1.27,0; K 1.27,0
PTV112 = drill 1.1 pad 1.676: 1.1 -3,-11; 1.2 -5,-11; 1.3 5,-11; 2.1 -1,-11; 2.2 1,-11; 2.3 3,-11 | drill 1.6 pad 2.8 square: M1 -6.8,0; M2 6.8,0
0603-RES = smd 1.1 x 1: 1 -0.85,0; 2 0.85,0

### Placement (x,y rotation side)
C1  88.57,63.77 180 bottom
C2  5.08,51.19 0 bottom
C3  10.81,58.87 180 bottom
C4  94.24,58.87 180 bottom
C5  87.58,51.15 0 bottom
C6  21.32,70.75 90 bottom
C7  3.69,8.16 270 bottom
C8  8,8 90 bottom
C9  12.64,75.47 270 bottom
C10  9.89,40.1 270 bottom
C11  15,8 90 bottom
C18  33.32,70.75 90 bottom
C19  20.69,8.16 270 bottom
C20  25.89,40.1 270 bottom
C21  26.64,75.47 270 bottom
C22  31,8 90 bottom
C23  24,8 90 bottom
C24  47.32,70.75 90 bottom
C25  35.69,8.16 270 bottom
C26  41.89,40.1 270 bottom
C27  39.64,75.47 270 bottom
C28  47,8 90 bottom
C29  40,8 90 bottom
C42  60.32,70.75 90 bottom
C43  51.69,8.16 270 bottom
C44  57.89,40.1 270 bottom
C45  52.64,75.47 270 bottom
C46  63,8 90 bottom
C47  56,8 90 bottom
C48  73.32,70.75 90 bottom
C49  68.69,8.16 270 bottom
C50  73.89,40.1 270 bottom
C51  65.64,75.47 270 bottom
C52  79,8 90 bottom
C53  72,8 90 bottom
C54  85.32,70.75 90 bottom
C55  83.69,8.16 270 bottom
C56  89.89,40.1 270 bottom
C57  78.64,75.47 270 bottom
C58  95,8 90 bottom
C59  88,8 90 bottom
IC1  50,57 0 bottom
IC2  9.98,16.34 0 bottom
IC4  25.98,16.34 0 bottom
IC5  41.98,16.34 0 bottom
IC8  57.98,16.34 0 bottom
IC9  73.98,16.34 0 bottom
IC10  89.98,16.34 0 bottom
J1  17,73.57 180 top
J3  30,73.57 180 top
J4  43,73.57 180 top
J6  56,73.57 180 top
J8  92.66,78.96 270 top
J9  69,73.57 180 top
J11  82,73.57 180 top
JP1  95.24,72.55 0 top
LED1  91,72 180 top
OUTPUT1  6.99,54.99 270 top
OUTPUT2  93,55 90 top
POT1  34,55 90 top
POT2  66,55 270 top
POT3  10,14 0 top
POT4  10,39.68 0 top
POT7  26,14 0 top
POT8  26,39.68 0 top
POT9  42,14 0 top
POT10  42,39.68 0 top
POT15  58,14 0 top
POT16  58,39.68 0 top
POT17  74,14 0 top
POT18  74,39.68 0 top
POT19  90,14 0 top
POT20  90,39.68 0 top
R1  60,62 270 bottom
R2  52,51.01 0 bottom
R3  48,51 0 bottom
R4  8,33 90 bottom
R5  11,32.99 90 bottom
R6  11.71,6.91 90 bottom
R7  3,19 90 bottom
R8  13.03,37.27 270 bottom
R9  13.05,41.87 270 bottom
R10  6,41 270 bottom
R11  17,19 90 bottom
R20  27.71,6.91 90 bottom
R21  22,41 270 bottom
R22  24,33 90 bottom
R23  27,32.99 90 bottom
R24  29.03,37.27 270 bottom
R25  29.05,41.87 270 bottom
R26  20,19 90 bottom
R27  33,19 90 bottom
R28  43.71,6.91 90 bottom
R29  38,41 270 bottom
R30  40,33 90 bottom
R31  43,32.99 90 bottom
R32  45.03,37.27 270 bottom
R33  45.05,41.87 270 bottom
R34  35,19 90 bottom
R35  49,19 90 bottom
R52  59.71,6.91 90 bottom
R53  54,41 270 bottom
R54  56,33 90 bottom
R55  59,32.99 90 bottom
R56  61.03,37.27 270 bottom
R57  61.05,41.87 270 bottom
R58  51,19 90 bottom
R59  65,19 90 bottom
R60  75.71,6.91 90 bottom
R61  70,41 270 bottom
R62  72,33 90 bottom
R63  75,32.99 90 bottom
R64  77.03,37.27 270 bottom
R65  77.05,41.87 270 bottom
R66  68,19 90 bottom
R67  81,19 90 bottom
R68  91.71,6.91 90 bottom
R69  86,41 270 bottom
R70  88,33 90 bottom
R71  91,32.99 90 bottom
R72  93.03,37.27 270 bottom
R73  93.05,41.87 270 bottom
R74  83,19 90 bottom
R75  97,19 90 bottom

### Tracks (layer width: path | path; a pad name or v marks a point on that pad's centre or on a via)
5V  (via drill 0.35)
  Top 0.305: v10,14.5 10,16 12.5,18.5 v12.5,24.25 | v42,24 v42,16.75 | v59.5,4.75 50.75,4.75 v43.25,12.25 | LED1.A 92.25,72 90.25,70 v90.25,66 89.5,66 v76.75,53.25 | v90,12.25 90,15.25 88.75,16.5 88.75,23 83,28.75 v83,32.5
  Top 0.406: J8.VBUS 93.96,75.43 94.74,74.65 96.44,74.65 97.96,73.13 JP1.2
  Bottom 0.305: 56,34 57.25,35.25 60,35.25 61,36.25 R56.2 61.25,36.5 77,36.5 R64.2 | 40,34 41.75,35.75 44.5,35.75 45,36.25 R32.2 45.25,36.25 53.75,36.25 56,34 | v10,14.5 10,13.5 IC2.4 | 13.75,25.5 16.25,28 16.25,36.25 | 13.75,25.5 v12.5,24.25 | 16.25,36.25 13.25,36.25 R8.2 13,36.25 10.25,36.25 8,34 R4.2 | v42,16.75 42,13.5 IC5.4 42,13.25 42,12.75 42.25,12.5 43,12.5 v43.25,12.25 | v42,24 36.75,24 36,23.25 34.75,23.25 34,24 15.25,24 13.75,25.5 | v59.5,4.75 60.75,4.75 60.75,9.5 60.5,9.75 60,9.75 58,11.75 58,13.25 IC8.4 | 16.25,36.25 29,36.25 R24.2 29.25,36.25 37.75,36.25 40,34 | 40,34 R30.2 | 56,34 R54.2 | v90.25,66 90.25,64 C1.A | JP1.2 97.75,72.5 96.5,71.25 93.25,71.25 92.5,72 LED1.A | IC1.4 50,52.5 49.5,52.5 49,52 48.25,52 47.25,51 | v90,12.25 90,13.25 IC10.4 | 84.25,33.75 v83,32.5 | 84.25,33.75 88,33.75 R70.2 88,34 88.75,34.75 91.5,34.75 93,36.25 R72.2 | 84.25,33.75 79.75,33.75 77.25,36.25 R64.2 | 47.25,51 54.25,44 76.75,44 | 76.75,44 77.5,44 79,42.5 79,36.5 77.25,36.5 R64.2 | 47.25,51 R3.2 | 76.75,44 v76.75,53.25
COPY\  (via drill 0.35)
  Top 0.305: v12.75,12.5 12.75,5.25 POT3.1.3
  Bottom 0.305: 12,13.25 11.25,13.25 IC2.2 | v12.75,12.5 12,13.25 | 12,13.25 IC2.1
COPY\2  (via drill 0.35)
  Top 0.305: v30.25,12.25 30.25,3.75 POT7.1.3
  Bottom 0.305: 28,13.25 27.25,13.25 IC4.2 | 28,13.25 29,12.25 v30.25,12.25 | 28,13.25 IC4.1
COPY\3  (via drill 0.35)
  Top 0.305: v44,10.25 47,7.25 POT9.1.3
  Bottom 0.305: 44,13.25 43.25,13.25 IC5.2 | v44,10.25 44,13.25 | 44,13.25 IC5.1
COPY\6  (via drill 0.35)
  Top 0.305: v59.25,11.75 59.25,7.5 63,3.75 POT15.1.3
  Bottom 0.305: 59.25,13.25 60,13.25 IC8.1 | v59.25,11.75 59.25,13.25 | 59.25,13.25 IC8.2
COPY\7  (via drill 0.35)
  Top 0.305: v76,12.25 76,6 POT17.1.3
  Bottom 0.305: IC9.2 75.25,13.5 76,13.5 IC9.1 76,13.25 v76,12.25
COPY\8
  Bottom 0.305: IC10.2 91.25,13.5 92,13.5 IC10.1 92,13.25 94.25,11 96,11 96.25,10.75 96.25,3 POT19.1.3
DLE  (via drill 0.35)
  Top 0.305: v8.5,11.5 8.5,25 5,28.5 POT4.1.2
  Bottom 0.305: C8.A 8,11.5 | 8,11.5 8,13.25 IC2.7 | v8.5,11.5 8,11.5
DLE2  (via drill 0.35)
  Top 0.305: v21.75,12 15.25,12 15,12.25 15,15.75 15.75,16.5 v15.75,24.75
  Bottom 0.305: C23.A 24,12 | 24,12 24,13.25 IC4.7 | v21.75,12 24,12 | v15.75,24.75 18.25,27.25 19.75,27.25 21,28.5 POT8.1.2
DLE3  (via drill 0.35)
  Top 0.305: v39.25,14.25 39.25,18.75 40.25,19.75 40.25,25.25 37,28.5 POT10.1.2
  Bottom 0.305: C29.A 40,13.25 IC5.7 40,13.5 v39.25,14.25
DLE6  (via drill 0.35)
  Top 0.305: v56.5,11.5 56.5,17.25 v50.5,23.25
  Bottom 0.305: C47.A 56,11.5 | 56,11.5 56,13.25 IC8.7 | v56.5,11.5 56,11.5 | v50.5,23.25 50.5,27.25 51.75,27.25 53,28.5 POT16.1.2
DLE7  (via drill 0.35)
  Top 0.305: v78.25,13.25 78.25,16.75 82,20.5 v82,27.5
  Bottom 0.305: C53.A 72,11.5 | 72,11.5 72,13.25 IC9.7 | 72,11.5 76.5,11.5 v78.25,13.25 | v82,27.5 79.5,30 70.25,30 69,28.75 POT18.1.2
DLE8  (via drill 0.35)
  Top 0.305: v70,5 64.75,5 62,7.75 62,17.75 65.5,21.25 v65.5,23.25
  Bottom 0.305: C59.A 88,11.25 | 88,11.25 88,13.25 IC10.7 | 88,11.25 82.75,11.25 80.5,9 80.5,5 v70,5 | v65.5,23.25 67.75,25.5 83.25,25.5 85,27.25 POT20.1.2
GND  (via drill 0.35)
  Top 0.305: POT9.2.1 POT9.1.1 | POT3.2.1 POT3.1.1 | POT7.2.1 POT7.1.1 | v48.5,2.25 49,1.75 53.75,1.75 POT15.1.1 POT15.2.1 58.25,1.75 64.5,1.75 v65.25,2.5 | POT17.2.1 POT17.1.1 | v88,18 88,14.5 89.25,13.25 89.25,8.5 91,6.75 91,5.75 90.75,5.5 88.25,5.5 87,4.25 POT19.1.1 POT19.2.1 | v12.25,33.5 5,40.75 5,43.5 | 5,43.5 5,48.5 2.5,51 OUTPUT1.1 4.25,53 4.5,53 11.5,60 11.5,76.5 13,78 J1.1 13.25,78.25 15.25,78.25 16.25,79.25 25,79.25 26,78.25 J3.1 26.25,78.25 28.25,78.25 29.25,79.25 38,79.25 39,78.25 J4.1 39.25,78 39.25,77.5 50,66.75 | v30,40 v30,33 | v11.75,43.5 5,43.5 | 50,73.75 50,76 52,78 J6.1 | 50,73.75 50,66.75 | 50,66.75 v50,62.75 v50,58.75 51.75,57 51.75,54.5 52.75,53.5 v52.75,53 | 50,73.75 60.75,73.75 65,78 J9.1 65.25,78.25 67.25,78.25 68.25,79.25 77,79.25 78,78.25 J11.1 78,78 86,70 | 86,70 v86.75,69.25 | v92.25,33 v89.75,35.5 89.75,40.75 | 93,63 93,70.5 94.25,71.75 | 93,63 93,62.75 96.75,59 97.5,59 OUTPUT2.1 | 94.25,71.75 95,72.5 JP1.1 | 89.75,40.75 89.75,51.75 86.5,55 86.5,61.75 87.75,63 93,63 | 89.75,40.75 v82,33 | 86,70 89.25,73.25 91.36,73.25 92.75,73.25 94.25,71.75 | v37,25.5 v37,21
  Top 0.406: J8.GND 91.36,73.25
  Bottom 0.305: POT3.2.1 10.25,1.75 21.75,1.75 | POT7.1.1 21.75,1.75 | 37.75,1.75 POT9.1.1 | 21.75,1.75 37.75,1.75 | v48.5,2.25 48,1.75 37.75,1.75 | v88,18 90,18 90,19.25 IC10.11 | POT17.2.1 74.25,1.75 85.75,1.75 POT19.1.1 | 25.25,21 10,21 10,19.5 IC2.11 | 25.25,21 26,20.25 26,19.5 IC4.11 | 42,21 42,19.5 IC5.11 | 25.25,21 v37,21 42,21 | 58,21 58,19.5 IC8.11 | 42,21 58,21 | 58,21 70,21 | 70,21 74,21 74,19.5 IC9.11 | POT17.1.1 69.75,1.75 68.5,1.75 66.5,3.75 | 66.5,3.75 66.5,12 68.75,12 70,13.25 70,21 | 66.5,3.75 v65.25,2.5 | v12.25,33.5 11,32.25 R5.1 | 31.5,31 42,31 43,32 R31.1 | 31.5,31 30,31 | 30,31 28,31 27,32 R23.1 | R25.1 29,42.75 28.5,43.25 13.75,43.25 13.25,42.75 R9.1 13,42.75 12.5,42.75 v11.75,43.5 | 60.5,43.25 45.75,43.25 45.25,42.75 R33.1 45,42.75 43,44.75 31.25,44.75 29.25,42.75 R25.1 | 60.5,43.25 61,42.75 R57.1 | 60.5,43.25 76.5,43.25 77,42.75 R65.1 | v30,33 30,31 | v30,40 30,42.5 29.25,42.5 R25.1 | v50,58.75 IC1.11 | v52.75,53 52.75,51.25 R2.1 | v50,62.75 60,62.75 R1.1 | v86.75,69.25 86.75,64 C1.C | R55.1 59,32 60,31 74,31 75,32 R63.1 75,32.25 75.75,33 v82,33 | v92.25,33 91.75,33 91,32.25 R71.1 | v89.75,35.5 92,37.75 92,42.5 93,42.5 R73.1 | 31.5,31 v37,25.5
N$1  (via drill 0.35)
  Top 0.305: v13.25,20.25 13.25,28.25 13,28.5 POT4.2.3
  Bottom 0.305: v13.25,20.25 11.25,20.25 11.25,19.5 IC2.13 | R10.2 6,40 10.75,40 11.25,39.5 11.25,37 9.5,37 5.75,33.25 5.75,30 11.75,30 13,28.75 POT4.2.3
N$2
  Bottom 0.305: R7.1 3,18 6.25,14.75 6.25,6.5 8,6.5 C8.C
N$3
  Bottom 0.305: POT3.1.2 3.75,3 3.75,6.5 C7.A
N$4  (via drill 0.35)
  Top 0.305: v7.75,8 v7.75,14.5 | POT4.1.3 15,16.5 14.25,15.75 v14.25,12.75
  Bottom 0.305: v7.75,14.5 8.75,14.5 8.75,13.5 IC2.6 | 9.5,8 11.5,8 R6.2 | 9.5,8 v7.75,8 | 9.5,8 v14.25,12.75
N$5  (via drill 0.35)
  Top 0.305: v7.75,16.25 7.75,24.5 5,27.25 4.5,27.25 3.75,28 3.75,29.25 v6.5,32 | v21.25,56.75 21.25,47.5 12,38.25 v12,35
  Bottom 0.305: v7.75,16.25 8.75,15.25 10.75,15.25 10.75,13.5 IC2.3 | v6.5,32 8,32 R4.1 8,32.25 9.5,32.25 11,33.75 R5.2 11,34 v12,35 | v21.25,56.75 21.25,69 C6.C
N$6
  Bottom 0.305: R11.1 17,18 15,16 15,11 16,11 16.25,10.75 16.25,6.5 15,6.5 C11.C
N$7  (via drill 0.35)
  Top 0.305: v51,55.75 45.5,61.25 44.5,61.25 43.75,60.5 43.75,51.25 POT1.1.2
  Bottom 0.305: v51,55.75 52,55.75 52,54.25 IC1.1 | POT1.1.2 4.5,50 3.5,51 C2.A
N$8
  Bottom 0.305: R6.1 11.5,6 10.5,5 7,5 5,7 5,9.75 3.75,9.75 C7.C
N$9  (via drill 0.35)
  Top 0.305: v12,14.75 12,4 POT3.2.3
  Bottom 0.305: 8.75,19.25 8,19.25 IC2.8 | 8.75,19.25 8.75,16 10.75,16 v12,14.75 | 8.75,19.25 IC2.9
N$10  (via drill 0.35)
  Top 0.305: v21.25,74.5 21.25,76 21,76.25 J1.3
  Bottom 0.305: v21.25,74.5 21.25,72.5 C6.A
N$11  (via drill 0.35)
  Top 0.305: v17.25,21.75 17.25,22.25 17.5,22.5 v17.5,37
  Bottom 0.305: v17.25,21.75 9.25,21.75 9.25,19.5 IC2.10 | v17.5,37 14.25,37 13.25,38 R8.1 13.25,38.25 13.25,41 R9.2 13,41.25 12.75,41.25 10.75,43.25 2,43.25 2,52.25 2.25,52.5 4,52.5 8.75,57.25 10.5,57.25 10.5,75 12.5,77 C9.C
N$12  (via drill 0.35)
  Top 0.305: 12.75,69.75 12.75,69.25 13,69 J1.2 12.75,69.75 | 12.75,69.75 v12.75,71 | 12.75,69.75 17.75,64.75 J1.4
  Bottom 0.305: v12.75,71 12.75,73.75 C9.A
N$13  (via drill 0.35)
  Top 0.305: v14,27 14,18 11.25,15.25 11.25,3.25 POT3.2.2
  Bottom 0.305: v14,27 3.75,27 3.75,32.25 9.75,38.25 C10.A
N$14
  Bottom 0.305: C10.C 6,41.75 R10.1
N$15
  Bottom 0.305: R1.2 60,61.25 64.25,65.5 64.25,79.25 82.75,79.25 89.5,72.5 89.5,72 LED1.K
N$17
  Bottom 0.305: IC1.7 48,54.25 46.25,56 POT1.2.2 15.25,56 12.5,58.75 C3.A
N$18  (via drill 0.35)
  Top 0.305: v90.5,58.75 88.5,58.75 OUTPUT2.2 | v84.25,58.25 84.25,54.25 OUTPUT2.4
  Bottom 0.305: C4.C 92.5,58.75 v90.5,58.75 84.75,58.75 v84.25,58.25
N$19  (via drill 0.35)
  Top 0.305: v93.25,51.25 95.5,51.25 OUTPUT2.3
  Bottom 0.305: v93.25,51.25 89.25,51.25 C5.C
N$21
  Bottom 0.305: IC1.8 48,60 48,61.75 53.25,61.75 POT2.1.2 57.5,57.5 94.5,57.5 95.75,58.75 C4.A
N$23  (via drill 0.35)
  Top 0.305: v52.75,59 52.75,58.5 53.75,57.5 53.75,55.25 POT2.2.2
  Bottom 0.305: v52.75,59 52,59.75 IC1.14 | POT2.2.2 83,54 85.75,51.25 C5.A
N$24  (via drill 0.35)
  Top 0.305: v9.75,17.75 9.75,27.25 11,28.5 POT4.2.2 | v13.75,11 13.75,12 13.5,12.25 v13.5,15.75
  Bottom 0.305: 12,17.25 12,19.25 IC2.14 | 12,17.25 10.25,17.25 v9.75,17.75 | v13.75,11 15,9.75 C11.A | 12,17.25 v13.5,15.75
N$34  (via drill 0.35)
  Top 0.305: v29.5,20 29.5,26 27,28.5 POT8.2.2 | v30.25,16.75 v30.25,14.75
  Bottom 0.305: 29,19.5 28,19.5 IC4.14 | v29.5,20 29,19.5 | C22.A 31,14.75 v30.25,14.75 | v30.25,16.75 30.25,19.5 29,19.5
N$35  (via drill 0.35)
  Top 0.305: v28.5,25.75 v28.5,20.25 | v26.25,40 29,37.25 POT8.2.3
  Bottom 0.305: v28.5,20.25 27.25,20.25 27.25,19.5 IC4.13 | v28.5,25.75 28.5,28.5 29,28.5 POT8.2.3 | v26.25,40 22,40 R21.2
N$36  (via drill 0.35)
  Top 0.305: v24,18 24,15.25 23.75,15 23.75,8.25 POT7.2.3
  Bottom 0.305: 24,19.25 24.75,19.25 IC4.9 | v24,18 24,19.25 | 24,19.25 IC4.8
N$37  (via drill 0.35)
  Top 0.305: v26.75,14.5 34.25,22 v34.25,31.75 | v31,33.75 v31,62.25
  Bottom 0.305: v26.75,14.5 26.75,13.5 IC4.3 | v34.25,31.75 32.25,33.75 v31,33.75 27,33.75 | 27,33.75 25.5,33.75 24,32.25 R22.1 | 27,33.75 R23.2 | v31,62.25 32.5,63.75 33.25,63.75 33.25,69 C18.C
N$38  (via drill 0.35)
  Top 0.305: v26.5,71 26.5,69.25 26.25,69 J3.2 26.25,68.75 30.25,64.75 30.75,64.75 J3.4
  Bottom 0.305: v26.5,71 26.5,73.75 C21.A
N$39  (via drill 0.35)
  Top 0.305: v23.5,20.25 23.5,24.25 19.75,28 19.75,29.25 24.75,34.25 | v27.75,37.25 24.75,34.25 | 24.75,34.25 v24.75,56.75
  Bottom 0.305: v23.5,20.25 25.25,20.25 25.25,19.5 IC4.10 | v27.75,37.25 28.5,38 29,38 R24.1 29.25,38.25 29.25,41 R25.2 | v24.75,56.75 24.75,75.25 26.5,77 C21.C
N$40  (via drill 0.35)
  Top 0.305: v33.5,74.5 33.5,76 33.75,76.25 J3.3
  Bottom 0.305: v33.5,74.5 33.5,72.5 C18.A
N$41
  Bottom 0.305: POT7.1.2 20.75,3 20.75,6.5 C19.A
N$42
  Bottom 0.305: R20.1 27.5,6.25 25.5,8.25 22.5,8.25 21,9.75 20.75,9.75 C19.C
N$43  (via drill 0.35)
  Top 0.305: v24.5,14.5 24.5,11 v26.75,8.75 | v35.5,24 35.5,17.25 37,15.75 37,10.75 v31,4.75
  Bottom 0.305: v24.5,14.5 24.75,14.5 24.75,13.5 IC4.6 | v26.75,8.75 27.5,8 R20.2 27.75,7.75 28.75,7.75 28.75,6.25 30,5 30.75,5 v31,4.75 | v35.5,24 31,28.5 POT8.1.3
N$44  (via drill 0.35)
  Top 0.305: v15,37.75 13.75,37.75 13.5,37.5 13.5,32 16.75,28.75 16.75,22.5 16.5,22.25 16.5,20.25 23,13.75 23,7 POT7.2.2
  Bottom 0.305: v15,37.75 25.25,37.75 25.75,38.25 C20.A
N$45
  Bottom 0.305: C20.C 22,41.75 R21.1
N$46
  Bottom 0.305: R26.1 20,16 20.75,16 21,15.75 21,11.25 19.75,11.25 19.5,11 19.5,8 22,8 23.5,6.5 24,6.5 C23.C
N$47  (via drill 0.35)
  Top 0.305: v31.75,16.75 31,16 v31,8
  Bottom 0.305: v31.75,16.75 33,18 R27.1 | C22.C v31,8
N$48  (via drill 0.35)
  Top 0.305: v22.25,20.25 22.25,20.75 18.25,24.75 v18.25,28
  Bottom 0.305: v22.25,20.25 22.25,18.5 23.5,17.25 26,17.25 26,13.5 IC4.4 | v18.25,28 24,33.75 R22.2
N$49  (via drill 0.35)
  Top 0.305: POT10.2.2 43,28.5 44.75,26.75 v44.75,19.5 v47,17.25
  Bottom 0.305: v44.75,19.5 44,19.5 IC5.14 | v47,17.25 C28.A
N$50  (via drill 0.35)
  Top 0.305: v45.5,20.25 45.5,28 45,28.5 POT10.2.3 45,28.75 43,30.75 v43,36.5
  Bottom 0.305: v45.5,20.25 43.25,20.25 43.25,19.5 IC5.13 | v43,36.5 41.5,36.5 38,40 R29.2
N$51  (via drill 0.35)
  Top 0.305: v39.5,71 39.5,69.25 39.25,69 J4.2 39.25,68.75 43.25,64.75 43.75,64.75 J4.4
  Bottom 0.305: v39.5,71 39.5,73.75 C27.A
N$52  (via drill 0.35)
  Top 0.305: v40,18 40,7.75 35.75,3.5 35.75,2.5 36.5,1.75 43.75,1.75 POT9.2.3
  Bottom 0.305: 40,19.25 40.75,19.25 IC5.9 | v40,18 40,19.25 | 40,19.25 IC5.8
N$53  (via drill 0.35)
  Top 0.305: v47.25,74.5 47.25,76 47,76.25 J4.3
  Bottom 0.305: v47.25,74.5 47.25,72.5 C24.A
N$54  (via drill 0.35)
  Top 0.305: v42.75,24.75 v42.75,17.5 | v53.25,63.5 56.25,60.5 56.25,37.5 v52.5,33.75
  Bottom 0.305: v42.75,17.5 42.75,13.5 IC5.3 | v42.75,24.75 45.25,27.25 47.5,27.25 48.25,28 48.25,33.75 | 43,33.75 48.25,33.75 | 43,33.75 41.5,33.75 40,32.25 R30.1 | 43,33.75 R31.2 | v53.25,63.5 53,63.5 47.5,69 C24.C | 48.25,33.75 v52.5,33.75
N$55  (via drill 0.35)
  Top 0.305: v39.5,20.25 39.5,24.25 35.75,28 35.75,30.5 v43.5,38.25 | v37.75,44 v37.75,56.75
  Bottom 0.305: v39.5,20.25 41.25,20.25 41.25,19.5 IC5.10 | v43.5,38.25 45,38.25 R32.1 45.25,38.25 45.25,41 R33.2 45,41.25 44.75,41.25 42.75,43.25 38.5,43.25 v37.75,44 | v37.75,56.75 37.75,75.25 39.5,77 C27.C
N$56
  Bottom 0.305: POT9.1.2 35.75,3 35.75,6.5 C25.A
N$57
  Bottom 0.305: R28.1 43.5,6.25 42,6.25 41.25,5.5 41.25,5 39,5 37,7 37,9.75 35.75,9.75 C25.C
N$58  (via drill 0.35)
  Top 0.305: POT10.1.3 47,22.5 48.5,21 48.5,17.25 v45.5,14.25
  Bottom 0.305: IC5.6 40.75,13.25 40.75,11 41,11 43.25,8.75 43.25,8 43.5,8 R28.2 43.75,8 45.5,8 v45.5,14.25
N$59  (via drill 0.35)
  Top 0.305: v43.75,37.25 43.75,33.75 48.25,29.25 v48.25,26.75 | v44,24 44,17.5 44.75,16.75 v44.75,13.25 | v44,9 44,4 POT9.2.2
  Bottom 0.305: v43.75,37.25 43,37.25 42,38.25 C26.A | v48.25,26.75 45.5,24 v44,24 | v44.75,13.25 44.75,9 v44,9
N$60
  Bottom 0.305: C26.C 38,41.75 R29.1
N$61  (via drill 0.35)
  Top 0.305: 11.5,51.25 v9.5,51.25 | 11.5,51.25 15.75,55.5 OUTPUT1.4 | 11.5,51.25 OUTPUT1.2
  Bottom 0.305: v9.5,51.25 6.75,51.25 C2.C
N$62  (via drill 0.35)
  Top 0.305: v6,59 4.5,59 OUTPUT1.3
  Bottom 0.305: v6,59 9,59 C3.C
N$63  (via drill 0.35)
  Top 0.305: v36.75,17.5 36.75,17 38.25,15.5 v38.25,8.25
  Bottom 0.305: v36.75,17.5 35.5,17.5 35,18 R34.1 | v38.25,8.25 40,6.5 C29.C
N$64  (via drill 0.35)
  Top 0.305: v52.75,16 53,15.75 53,9 v52.25,8.25
  Bottom 0.305: v52.75,16 51,16 49,18 R35.1 | v52.25,8.25 52,8 48.75,8 47.25,6.5 47,6.5 C28.C
N$79  (via drill 0.35)
  Top 0.305: v52.5,71 52.5,69.25 52.25,69 J6.2 52.25,68.75 56.25,64.75 56.75,64.75 J6.4
  Bottom 0.305: v52.5,71 52.5,73.75 C45.A
N$81  (via drill 0.35)
  Top 0.305: v60.25,74.5 60.25,76 60,76.25 J6.3
  Bottom 0.305: v60.25,74.5 60.25,72.5 C42.A
N$92  (via drill 0.35)
  Top 0.305: v60.75,20.25 60.75,26.75 59,28.5 POT16.2.2 | v62.75,16.75 v62.75,14.25
  Bottom 0.305: v60.75,20.25 60,19.5 IC8.14 60,19.25 60.25,19.25 v62.75,16.75 | C46.A 63,14.25 v62.75,14.25
N$93  (via drill 0.35)
  Top 0.305: v59.25,26.75 v59.25,18 | v58.75,40 61,37.75 POT16.2.3
  Bottom 0.305: v59.25,18 59.25,19.25 IC8.13 | v59.25,26.75 61,28.5 POT16.2.3 | v58.75,40 54,40 R53.2
N$94  (via drill 0.35)
  Top 0.305: v55.75,14.5 55.75,10.25 61,5 POT15.2.3
  Bottom 0.305: 56,19.25 56.75,19.25 IC8.9 | 56,19.25 56,17.25 55.75,17 v55.75,14.5 | 56,19.25 IC8.8
N$95  (via drill 0.35)
  Top 0.305: v59,15 59,15.5 64.25,20.75 v64.25,31.75 64.25,35.25 60.5,39 v60.5,64
  Bottom 0.305: v59,15 58.75,15 58.75,13.5 IC8.3 | v64.25,31.75 62.25,33.75 59,33.75 | 59,33.75 57.5,33.75 56,32.25 R54.1 | 59,33.75 R55.2 | v60.5,64 60.5,69 C42.C
N$96  (via drill 0.35)
  Top 0.305: v54.75,20.25 54.75,20.75 49.5,26 v49.5,28.25 | v59.5,38 58,36.5 | 58,36.5 v54.75,33.25 | v58.75,71 58.75,41.25 58,40.5 58,36.5
  Bottom 0.305: v54.75,20.25 57.25,20.25 57.25,19.5 IC8.10 | v49.5,28.25 54.5,33.25 v54.75,33.25 | v59.5,38 61,38 R56.1 61.25,38.25 61.25,41 R57.2 | v58.75,71 52.75,77 C45.C
N$97
  Bottom 0.305: POT15.1.2 51.75,3 51.75,6.5 C43.A
N$98
  Bottom 0.305: R52.1 59.5,6 58.5,5 55,5 53,7 53,9.75 51.75,9.75 C43.C
N$99  (via drill 0.35)
  Top 0.305: POT16.1.3 63,20.25 v58,15.25 v58,9.5
  Bottom 0.305: v58,15.25 56.75,15.25 56.75,13.5 IC8.6 | v58,9.5 59.5,8 R52.2
N$100  (via drill 0.35)
  Top 0.305: v53,30.25 v58.75,36 | v41.25,23.25 41.25,6.75 v42.5,5.5
  Bottom 0.305: v58.75,36 58,36 58,38.25 C44.A | v53,30.25 52.75,30 52.5,30 49,26.5 49,23.25 v41.25,23.25 | v42.5,5.5 43.75,4.25 49.75,4.25 52.25,1.75 57.75,1.75 POT15.2.2
N$101
  Bottom 0.305: C44.C 54,41.75 R53.1
N$102
  Bottom 0.305: R58.1 51,18 52,17 54.5,17 54.75,16.75 54.75,6.5 56,6.5 C47.C
N$103  (via drill 0.35)
  Top 0.305: v66.25,18 67.5,18 69.75,15.75 69.75,12 v64.5,6.75
  Bottom 0.305: v66.25,18 65,18 R59.1 | v64.5,6.75 64.25,6.5 63,6.5 C46.C
N$104  (via drill 0.35)
  Top 0.305: v76,17.25 76,13.5 v78.25,11.25 | v76.75,21 v76.75,26.75
  Bottom 0.305: v76,17.25 76,19.25 IC9.14 76,19.5 76.75,19.5 v76.75,21 | v78.25,11.25 78.25,9.75 79,9.75 C52.A | v76.75,26.75 75,28.5 POT18.2.2
N$105  (via drill 0.35)
  Top 0.305: v65.5,71 65.5,69.25 65.25,69 J9.2 65.25,68.75 69.25,64.75 69.75,64.75 J9.4
  Bottom 0.305: v65.5,71 65.5,73.75 C51.A
N$106  (via drill 0.35)
  Top 0.305: v75.25,21 75.25,22.25 76,23 76,27.5 77,28.5 POT18.2.3 77,32 v70,39
  Bottom 0.305: v75.25,21 75.25,19.5 IC9.13 | v70,39 R61.2
N$107  (via drill 0.35)
  Top 0.305: v73.25,74.5 73.25,76 73,76.25 J9.3
  Bottom 0.305: v73.25,74.5 73.25,72.5 C48.A
N$108  (via drill 0.35)
  Top 0.305: v72.25,17.25 72.25,7.75 POT17.2.3
  Bottom 0.305: 72.25,19.25 72.75,19.25 IC9.9 | 72.25,19.25 72,19.25 IC9.8 | v72.25,17.25 72.25,19.25
N$109  (via drill 0.35)
  Top 0.305: v76.75,15 76.75,17.75 75,19.5 71,19.5 70,20.5 70,25.75 67.75,28 67.75,29.25 v70.5,32 | v73.5,58.25 73.5,36.75 v75,35.25
  Bottom 0.305: v76.75,15 74.5,15 74.5,13.5 IC9.3 | v70.5,32 72,32 R62.1 72,32.25 73.5,32.25 75,33.75 R63.2 v75,35.25 | v73.5,58.25 73.5,69 C48.C
N$110  (via drill 0.35)
  Top 0.305: v71.5,20.25 77.25,20.25 78,19.5 80.25,19.5 81.25,20.5 81.25,34.25 v78.25,37.25 78.25,51.75 83.25,56.75 v83.25,58.25
  Bottom 0.305: v71.5,20.25 73.25,20.25 73.25,19.5 IC9.10 | v78.25,37.25 77.5,38 77.25,38 R64.1 77.25,38.25 77.25,41 R65.2 | v83.25,58.25 83.25,61.5 74.25,70.5 72.25,70.5 65.75,77 C51.C
N$111
  Bottom 0.305: POT17.1.2 68.75,3 68.75,6.5 C49.A
N$112
  Bottom 0.305: C49.C 70.25,8.25 73.5,8.25 75.5,6.25 R60.1
N$113  (via drill 0.35)
  Top 0.305: v78.5,20.25 78.5,28 79,28.5 POT18.1.3 | v75.25,15.75 v75.25,10
  Bottom 0.305: v78.5,20.25 78.5,17.75 76.5,15.75 v75.25,15.75 72.75,15.75 72.75,13.5 IC9.6 | v75.25,10 75.5,10 75.5,8 R60.2
N$114  (via drill 0.35)
  Top 0.305: v70.5,37.25 70.5,33.5 66.25,29.25 66.25,20 71.25,15 71.25,6.75 POT17.2.2
  Bottom 0.305: v70.5,37.25 72.75,37.25 73.75,38.25 C50.A
N$115
  Bottom 0.305: C50.C 70,41.75 R61.1
N$116  (via drill 0.35)
  Top 0.305: v67,17.25 67.5,17.25 69,15.75 69,12.25 67.5,10.75 v67.25,10.75
  Bottom 0.305: v67,17.25 67.25,17.25 68,18 R66.1 | v67.25,10.75 67.25,8 69.75,8 71.25,6.5 72,6.5 C53.C
N$117  (via drill 0.35)
  Top 0.305: v79,16 79,12.25 79.25,12 79.5,12 79.75,11.75 v79.75,8
  Bottom 0.305: v79,16 81,18 R67.1 | v79.75,8 79.75,6.5 79,6.5 C52.C
N$118  (via drill 0.35)
  Top 0.305: v74.25,12.25 74.25,17.5 73.75,18 70.25,18 67,21.25 v67,28.75 | v69.5,33.75 v65.75,30
  Bottom 0.305: v74.25,12.25 74,12.25 74,13.25 IC9.4 | v65.75,30 v67,28.75 | v69.5,33.75 72,33.75 R62.2
N$119  (via drill 0.35)
  Top 0.305: v92,20.75 92,27.5 91,28.5 POT20.2.2 | v93.5,16 v93.5,10.25
  Bottom 0.305: v92,20.75 92,19.5 IC10.14 92,19.25 93.5,19.25 v93.5,16 | v93.5,10.25 94.5,10.25 95,9.75 C58.A
N$120  (via drill 0.35)
  Top 0.305: v91.25,26.75 v91.25,21.5 | v86,35.75 93,28.75 POT20.2.3
  Bottom 0.305: v91.25,21.5 91.25,19.5 IC10.13 | v91.25,26.75 93,28.5 POT20.2.3 | v86,35.75 R69.2
N$121  (via drill 0.35)
  Top 0.305: v85.25,10.5 v85.25,12.75 | v88.75,4.75 91.25,4.75 POT19.2.3
  Bottom 0.305: IC10.9 88.75,19.25 88,19.25 IC10.8 88,19.5 85.5,19.5 85.25,19.25 v85.25,12.75 | v85.25,10.5 86.75,9 86.75,4.75 v88.75,4.75
N$122  (via drill 0.35)
  Top 0.305: v90.75,14.5 93,16.75 93,25.25 95,27.25 95.5,27.25 96.25,28 96.25,30.5 v93,33.75 93,34 92.5,34.5 92.5,58 v88.25,62.25
  Bottom 0.305: v90.75,14.5 90.5,14.5 90.5,13.5 IC10.3 | 91,33.75 v93,33.75 | 91,33.75 89.5,33.75 88,32.25 R70.1 | 91,33.75 R71.2 | v88.25,62.25 85.5,62.25 85.5,69 C54.C
N$123  (via drill 0.35)
  Top 0.305: v88,21.75 88,22.5 v83,27.5
  Bottom 0.305: v88,21.75 89.25,21.75 89.25,19.5 IC10.10 | v83,27.5 83,31 91.75,31 94,33.25 94,38 93.25,38 R72.1 93.25,38.25 93.25,41 R73.2 93.25,41.25 94,41.25 94,55.5 95.75,57.25 97.25,57.25 97.25,60 97,60.25 93,60.25 93,64.5 86.75,70.75 84,70.75 84,71.75 78.75,77 C57.C
N$124
  Bottom 0.305: POT19.1.2 83.75,3 83.75,6.5 C55.A
N$125  (via drill 0.35)
  Top 0.305: v90.25,6.25 88.25,6.25 v85.25,9.25
  Bottom 0.305: v90.25,6.25 91.5,6.25 R68.1 | v85.25,9.25 84.75,9.75 83.75,9.75 C55.C
N$126  (via drill 0.35)
  Top 0.305: v90.5,24 90.5,20 91.5,19 v91.5,16.5 | v92.75,9.5 v92.75,15.25
  Bottom 0.305: 91.5,8.5 89,11 88.75,11 88.75,13.25 IC10.6 | 91.5,8.5 91.5,8 R68.2 | v90.5,24 95,28.5 POT20.1.3 | v92.75,15.25 v91.5,16.5 | v92.75,9.5 91.75,8.5 91.5,8.5
N$127  (via drill 0.35)
  Top 0.305: v86,34.5 86,31.75 v83.75,29.5 | v82.75,26.25 82.75,22 v86,18.75 | v86.5,15.75 86.5,15.25 88.5,13.25 88.5,8 v89.5,7
  Bottom 0.305: v86,34.5 89.75,38.25 C56.A | v83.75,29.5 83.75,26.75 83.25,26.75 v82.75,26.25 | v86,18.75 86,15.75 v86.5,15.75 | v89.5,7 89.5,4.25 89.75,4.25 POT19.2.2
N$128
  Bottom 0.305: C56.C 86,41.75 R69.1
N$129  (via drill 0.35)
  Top 0.305: v84.5,16.5 87.25,13.75 87.25,8.5 v87.75,8
  Bottom 0.305: v84.5,16.5 83,18 R74.1 | v87.75,8 87.75,6.5 88,6.5 C59.C
N$130  (via drill 0.35)
  Top 0.305: v95,8 v95,16
  Bottom 0.305: v95,16 97,18 R75.1 | C58.C v95,8
N$131  (via drill 0.35)
  Top 0.305: v78.5,71 78.5,69.25 78.25,69 J11.2 78.25,68.75 82.25,64.75 82.75,64.75 J11.4
  Bottom 0.305: v78.5,71 78.5,73.75 C57.A
N$132  (via drill 0.35)
  Top 0.305: v85.5,74.5 85.5,76 85.75,76.25 J11.3
  Bottom 0.305: v85.5,74.5 85.5,72.5 C54.A
OUT-L  (via drill 0.35)
  Top 0.305: 54.5,50 v51.5,53 51.5,53.5 POT1.1.3 | v18.25,20.25 v18.25,22.5 | v36.25,21.75 v36.25,20.25 | v50.5,21.75 v52.25,20 | v67.75,21.75 v69.25,20.25 | 54.5,50 54.5,37 51.75,34.25 51.75,25.75 v55.75,21.75 | 54.5,50 POT2.1.3
  Bottom 0.305: POT1.1.3 46,59 48.75,59 48.75,59.75 IC1.9 | v51.5,53 51.25,53 51.25,54 IC1.2 | v18.25,20.25 18.5,20 20,20 R26.2 | R7.2 3,20 3.75,20.75 7.5,20.75 9.25,22.5 v18.25,22.5 19,21.75 v36.25,21.75 v50.5,21.75 v55.75,21.75 v67.75,21.75 83,21.75 R74.2 | v36.25,20.25 35.25,20.25 35,20 R34.2 | v52.25,20 51,20 R58.2 | v69.25,20.25 68.25,20.25 68,20 R66.2
OUT-R  (via drill 0.35)
  Top 0.305: POT1.2.3 46.25,56.75 46.25,56.25 48.75,53.75 v48.75,53 48.75,48.25 32.75,32.25 v32.75,22.5 v30.5,20.25 30.5,19.75 30,19.25 v18.75,19.25 | POT2.2.3 52.5,54.5 v52.5,57.5 | v47.75,20.25 47.75,21 v46.25,22.5 | v61.75,22.5 v61.75,20.25 | v79.75,22.5 v79.75,20.25
  Bottom 0.305: v48.75,53 48.75,54 IC1.6 | 51.25,58 51.25,59.75 IC1.13 | POT1.2.3 51.25,58 | v52.5,57.5 52,58 51.25,58 | v18.75,19.25 17.5,19.25 17,19.75 R11.2 | v30.5,20.25 30.75,20 33,20 R27.2 | v47.75,20.25 48.75,20.25 49,20 R35.2 | v32.75,22.5 v46.25,22.5 v61.75,22.5 v79.75,22.5 91.5,22.5 93,21 96,21 97,20 R75.2 | v61.75,20.25 64.75,20.25 65,20 R59.2 | v79.75,20.25 80.75,20.25 81,20 R67.2
VGND  (via drill 0.35)
  Top 0.305: v9.25,12.25 9.25,16 10.75,17.5 v10.75,18 v10.75,23.25 | v25.25,12.25 v25.25,18 29.5,18 33.5,22 v33.5,23.25 33.5,32.25 51.5,50.25 | v73.25,17.25 v73.25,12.25 73.25,12 v74.5,10.75 | v57.25,12.25 v57.25,17.25 57.25,19 51,25.25 51,36 53,38 53,48.75 51.5,50.25 | v48.5,55.25 50,53.75 v50,51.75 51.5,50.25 | v80.5,10.25 80.5,2.75 79.5,1.75 67.25,1.75 v60,9
  Bottom 0.305: v9.25,12.25 9.25,13.25 IC2.5 | v10.75,18 10.75,19.25 IC2.12 | 41.25,16 41.25,18.25 42.25,18.25 42.5,18.5 42.5,19.25 IC5.12 | 41.25,16 41.25,13.5 IC5.5 | v25.25,12.25 25.25,13.25 IC4.5 | v25.25,18 25.5,18.25 26.25,18.25 26.5,18.5 | 26.5,18.5 26.5,19.25 IC4.12 | 41.25,16 29,16 26.5,18.5 | v33.5,23.25 v10.75,23.25 | 89.25,14.5 89.25,17.25 90.5,17.25 90.75,17.5 90.75,19.25 IC10.12 | 89.25,14.5 89.25,13.5 IC10.5 | v73.25,12.25 73.25,13.25 IC9.5 | v73.25,17.25 74.5,18.5 74.5,19.25 IC9.12 | 89.25,14.5 87.75,14.5 86,12.75 86,12 80.5,12 | 80.5,12 77.75,12 76.5,10.75 v74.5,10.75 | v57.25,17.25 58.5,18.5 58.5,19.25 IC8.12 | IC8.5 57.25,13.25 v57.25,12.25 57.25,11.75 v60,9 | 50,51 51,51 R2.2 | 50,51 R3.1 | 49.25,55 49.25,54.25 IC1.5 | 50.25,55 49.25,55 | 50.25,55 50.75,54.5 50.75,54.25 IC1.3 | 50.25,61 49.25,61 49.25,60 IC1.10 | 50.25,61 50.75,60.5 50.75,60 IC1.12 | 50.25,55 50.25,56.75 53,56.75 53.5,57.25 53.5,60.75 52.5,60.75 52.25,61 50.25,61 | v50,51.75 50,51 | v48.5,55.25 48.75,55 49.25,55 | v80.5,10.25 80.5,12

### Text on the board
tNames: Mixer / OPA-1644 / Rev-C / / Ali Momeni / 2017